# EAGLE design Rigid-Flex HDMI Switch (EAGLE 9.6.2)
CHECKED_BY: Maxim Yudayev; MADE_BY: Maxim Yudayev; RELEASE_DATE: May 7th, 2021; REV: v1.0; STATUS: Released

## Sheet 1 of 2: Cover
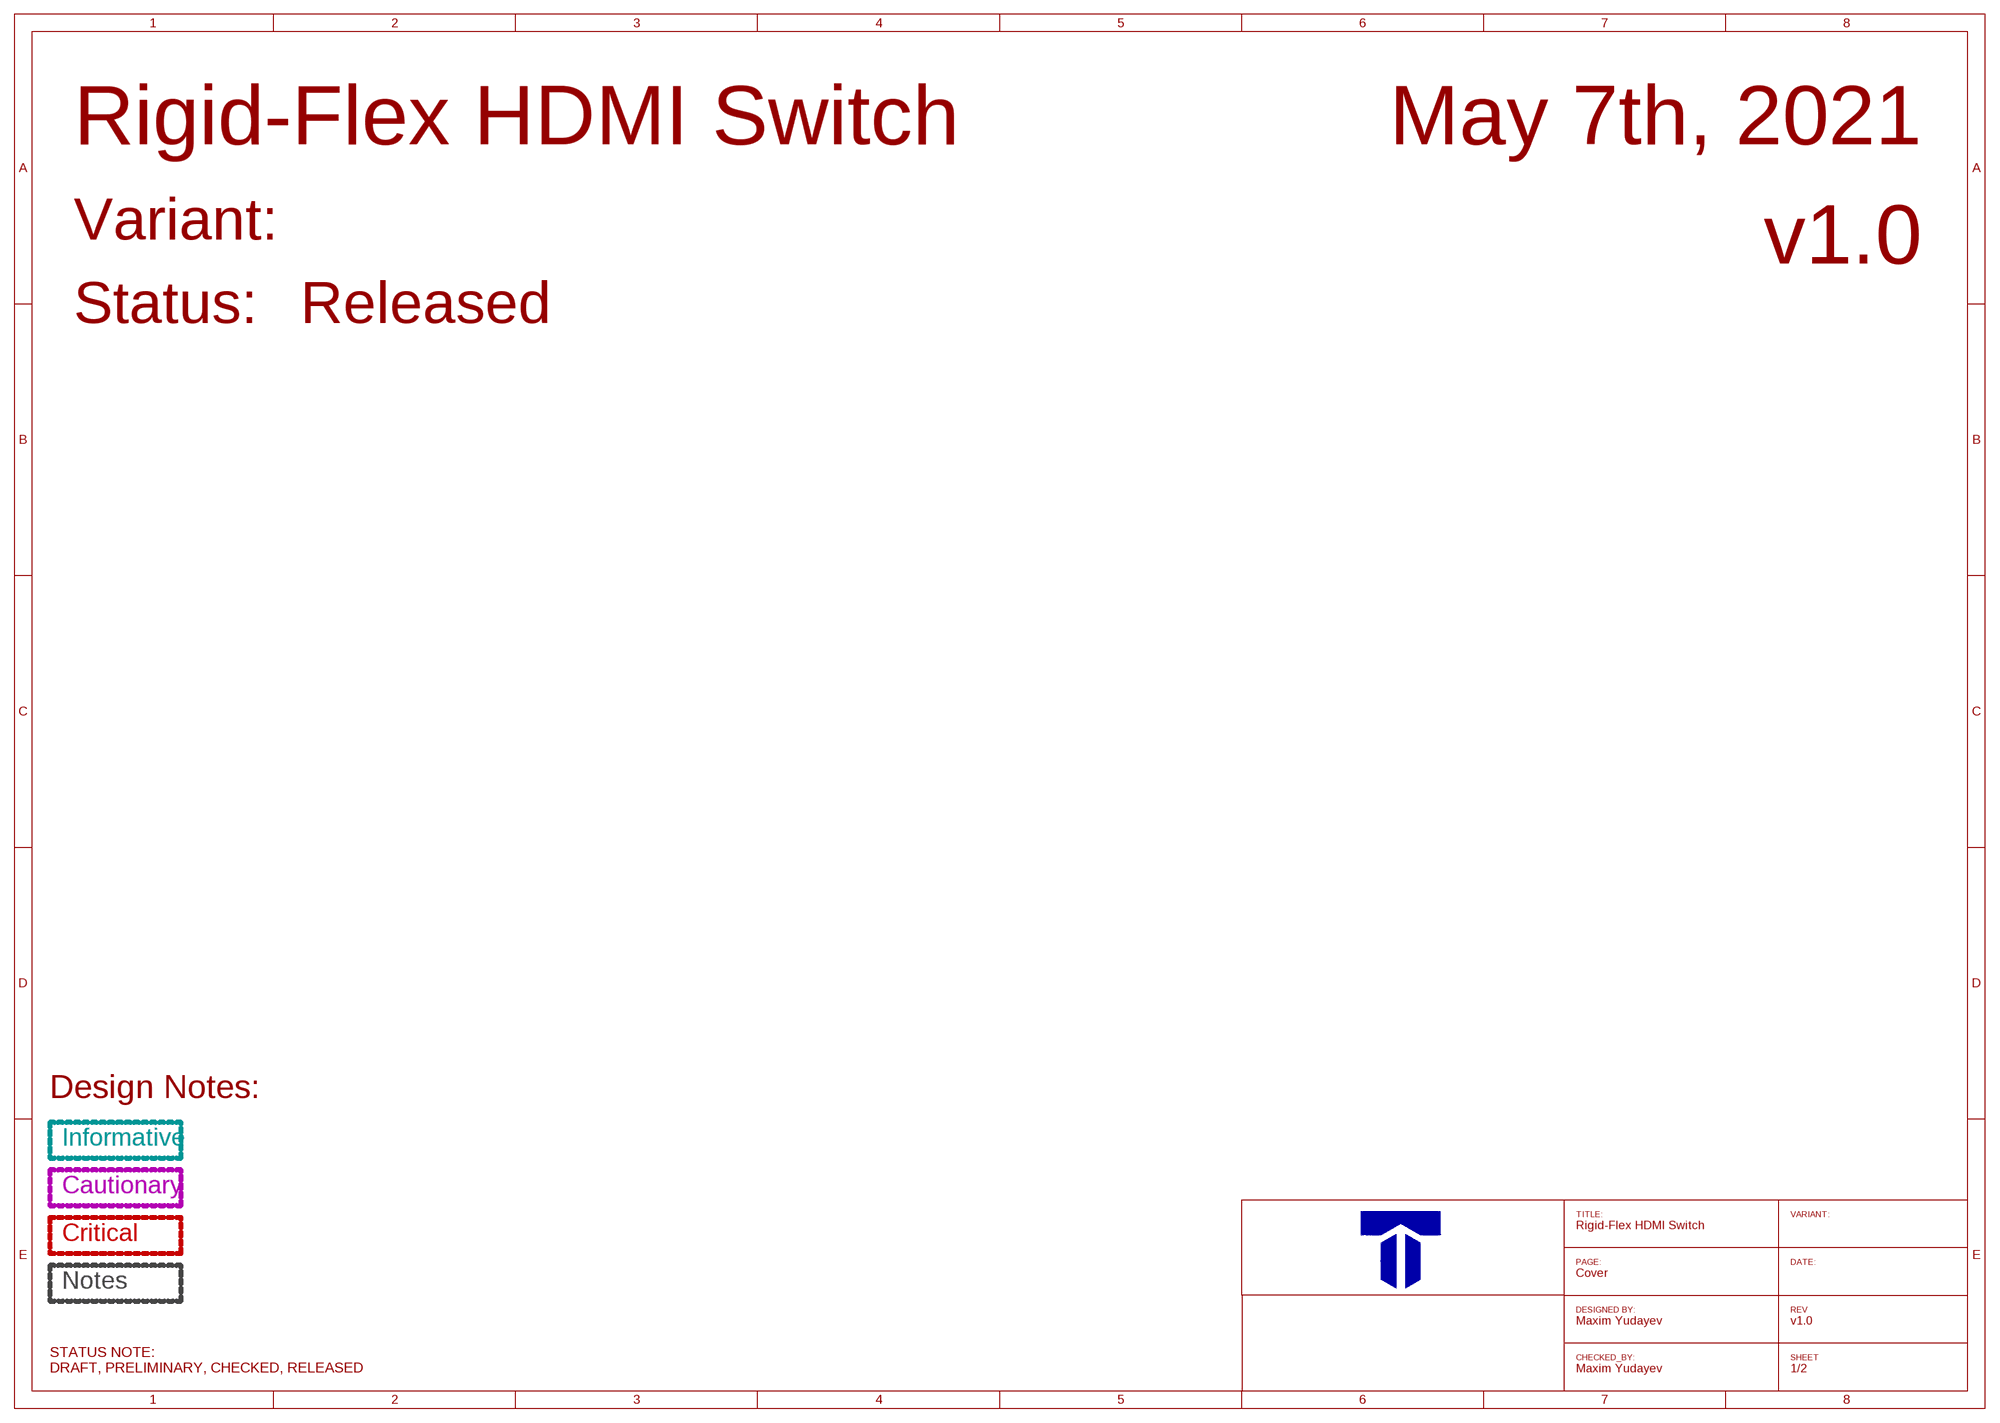
[diagram p0: schematic, sheet 1]

## Sheet 2 of 2: HDMI Switch
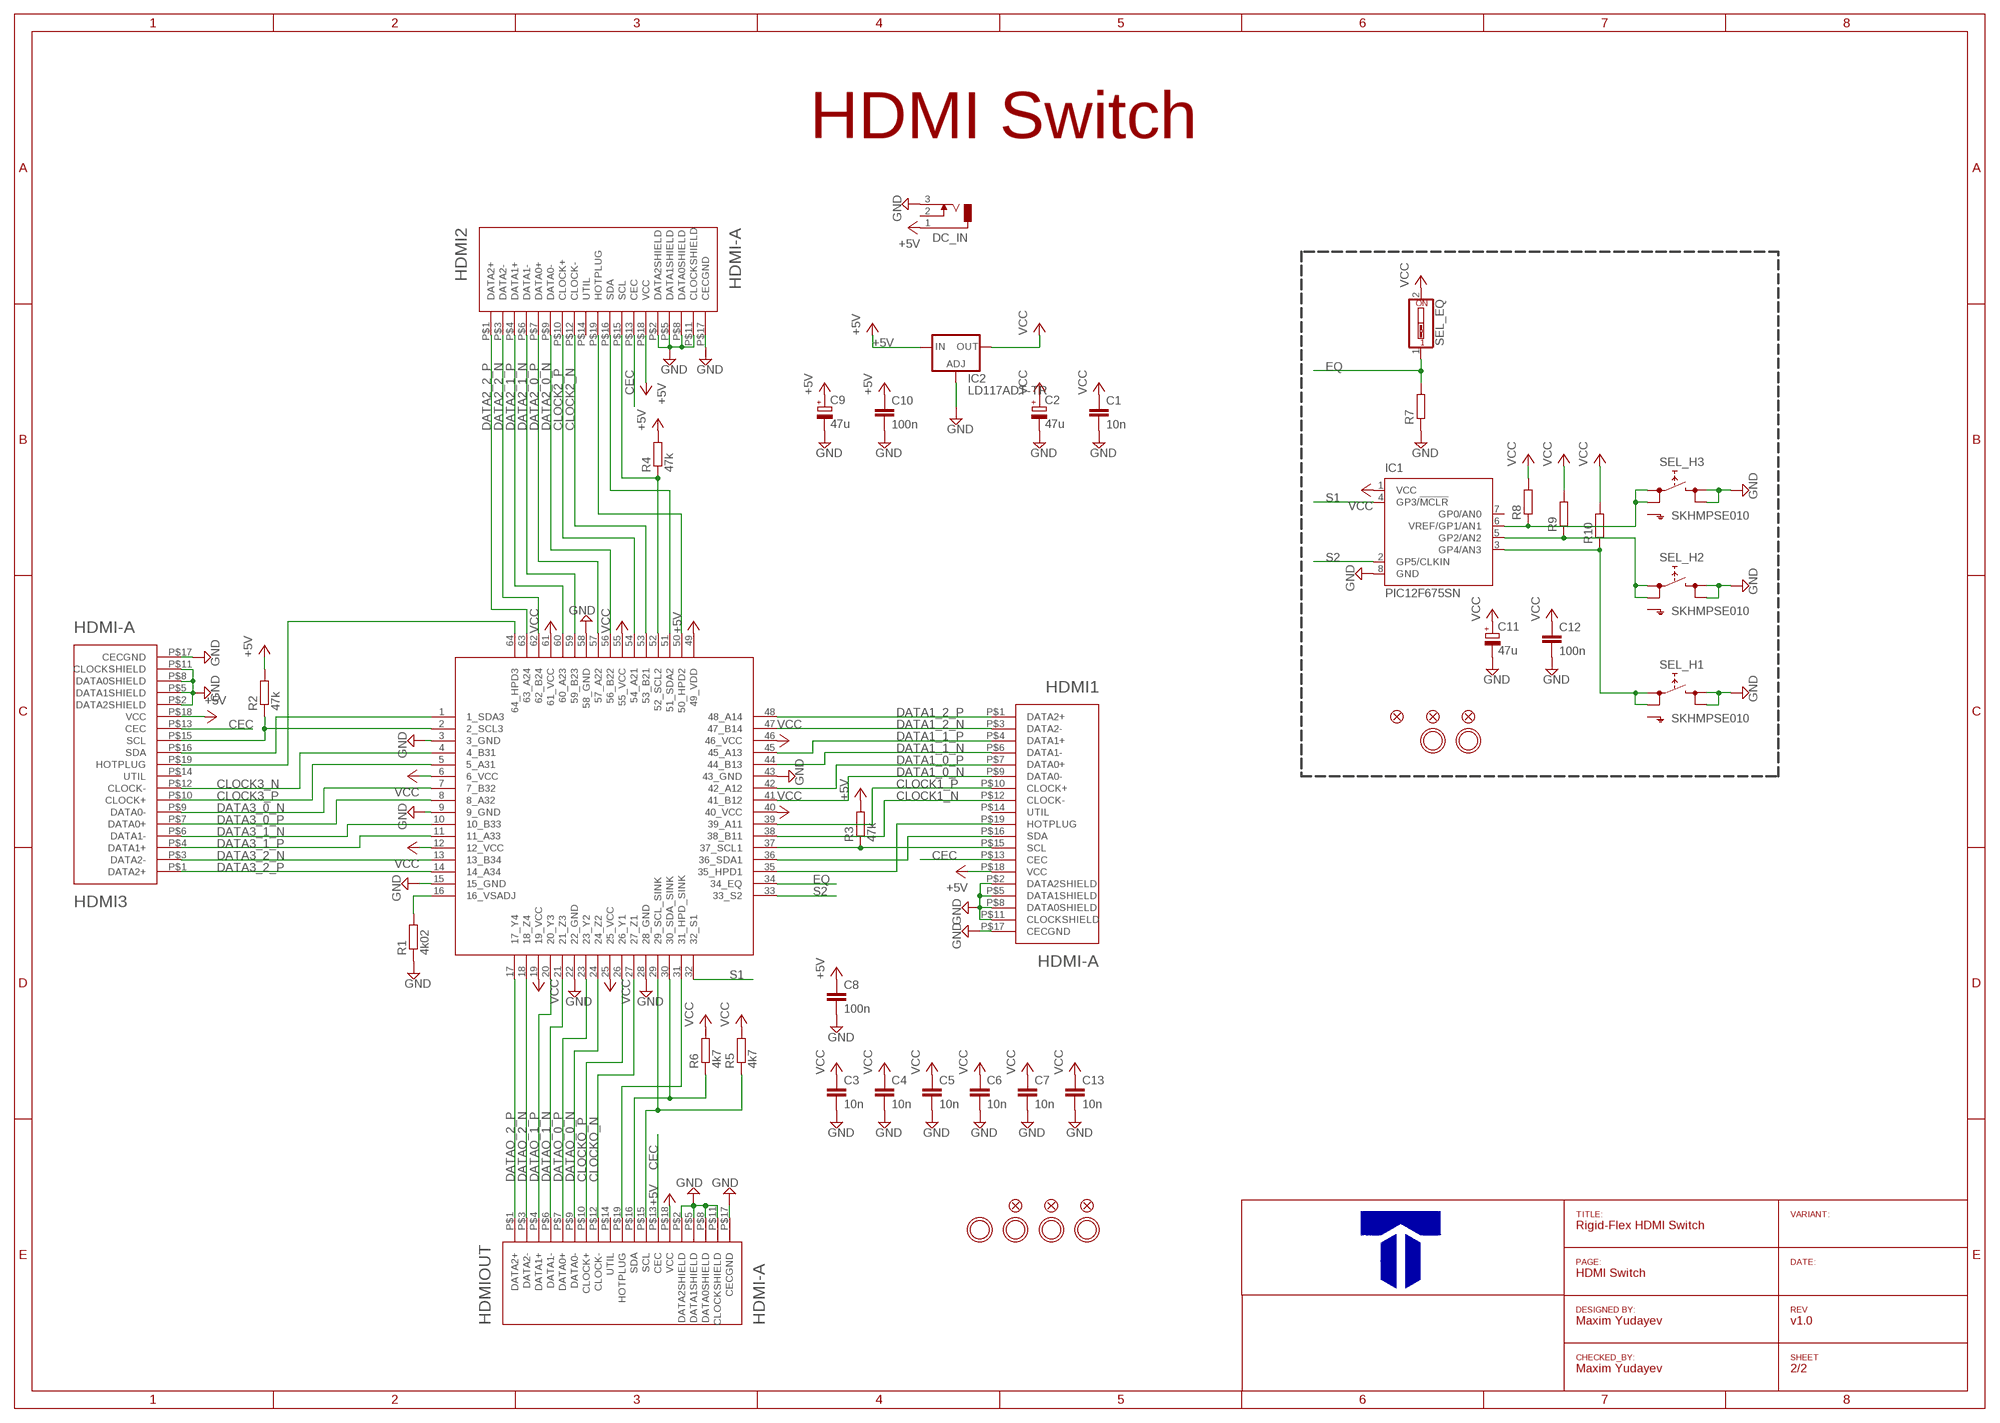
[diagram p1: schematic, sheet 2]

### Parts
C1  10n  C-EUC0402  [C0402]
C2  47u  CPOL-EUSMCA  [SMC_A]
C3  10n  C0402  [0402]
C4  10n  C0402  [0402]
C5  10n  C0402  [0402]
C6  10n  C0402  [0402]
C7  10n  C0402  [0402]
C8  100n  C0402  [0402]
C9  47u  CPOL-EUSMCA  [SMC_A]
C10  100n  C-EUC0402  [C0402]
C11  47u  CPOL-EUSMCA  [SMC_A]
C12  100n  C-EUC0402  [C0402]
C13  10n  C0402  [0402]
DC_IN  DCJ0303  [DCJ0303]
FID1  FIDUCIAL""  [FIDUCIAL_1MM]
FID2  FIDUCIAL""  [FIDUCIAL_1MM]
FID3  FIDUCIAL""  [FIDUCIAL_1MM]
FID4  FIDUCIAL""  [FIDUCIAL_1MM]
FID5  FIDUCIAL""  [FIDUCIAL_1MM]
FID6  FIDUCIAL""  [FIDUCIAL_1MM]
HDMI1  HDMI-A  [HDMI_A]
HDMI2  HDMI-A  [HDMI_A]
HDMI3  HDMI-A  [HDMI_A]
HDMIOUT  HDMI-A  [HDMI_A]
IC1  PIC12F675SN  [SO-08]
IC2  LD117ADT-TR  [DPACK]
R1  4k02  R0402  [0402]
R2  47k  R0402  [0402]
R3  47k  R0402  [0402]
R4  47k  R0402  [0402]
R5  4k7  R0402  [0402]
R6  4k7  R0402  [0402]
R7  R-EU_R0805  [R0805]
R8  R-EU_R0805  [R0805]
R9  R-EU_R0805  [R0805]
R10  R-EU_R0805  [R0805]
SEL_EQ  SW_DIP-1  [EDG-01]
SEL_H1  SKHMPSE010  [SKHMPXE010]
SEL_H2  SKHMPSE010  [SKHMPXE010]
SEL_H3  SKHMPSE010  [SKHMPXE010]
U1  TMDS351TQFP64  [QFP50P1200X1200X120-64]
U$1  MOUNTINGHOLE3.0  [MOUNTINGHOLE_3.0_PLATED]
U$2  MOUNTINGHOLE3.0  [MOUNTINGHOLE_3.0_PLATED]
U$31  MOUNTINGHOLE3.0  [MOUNTINGHOLE_3.0_PLATED]
U$32  MOUNTINGHOLE3.0  [MOUNTINGHOLE_3.0_PLATED]
U$33  MOUNTINGHOLE3.0  [MOUNTINGHOLE_3.0_PLATED]
U$34  MOUNTINGHOLE3.0  [MOUNTINGHOLE_3.0_PLATED]

### Nets
+5V: C8.1 C9.+ C10.1 DC_IN.1 HDMI1.P$18(VCC) HDMI2.P$18(VCC) HDMI3.P$18(VCC) HDMIOUT.P$18(VCC) IC2.3(IN) R2.2 R3.2 R4.2 U1.49(49_VDD)
CEC: HDMI1.P$13(CEC) HDMI2.P$13(CEC) HDMI3.P$13(CEC) HDMIOUT.P$13(CEC)
CLOCK1_N [100Ohm Diff]: HDMI1.P$12(CLOCK-) U1.38(38_B11)
CLOCK1_P [100Ohm Diff]: HDMI1.P$10(CLOCK+) U1.39(39_A11)
CLOCK2_N [100Ohm Diff]: HDMI2.P$12(CLOCK-) U1.53(53_B21)
CLOCK2_P [100Ohm Diff]: HDMI2.P$10(CLOCK+) U1.54(54_A21)
CLOCK3_N [100Ohm Diff]: HDMI3.P$12(CLOCK-) U1.4(4_B31)
CLOCK3_P [100Ohm Diff]: HDMI3.P$10(CLOCK+) U1.5(5_A31)
CLOCKO_N [100Ohm Diff]: HDMIOUT.P$12(CLOCK-) U1.27(27_Z1)
CLOCKO_P [100Ohm Diff]: HDMIOUT.P$10(CLOCK+) U1.26(26_Y1)
DATA1_0_N [100Ohm Diff]: HDMI1.P$9(DATA0-) U1.41(41_B12)
DATA1_0_P [100Ohm Diff]: HDMI1.P$7(DATA0+) U1.42(42_A12)
DATA1_1_N [100Ohm Diff]: HDMI1.P$6(DATA1-) U1.44(44_B13)
DATA1_1_P [100Ohm Diff]: HDMI1.P$4(DATA1+) U1.45(45_A13)
DATA1_2_N [100Ohm Diff]: HDMI1.P$3(DATA2-) U1.47(47_B14)
DATA1_2_P [100Ohm Diff]: HDMI1.P$1(DATA2+) U1.48(48_A14)
DATA2_0_N [100Ohm Diff]: HDMI2.P$9(DATA0-) U1.56(56_B22)
DATA2_0_P [100Ohm Diff]: HDMI2.P$7(DATA0+) U1.57(57_A22)
DATA2_1_N [100Ohm Diff]: HDMI2.P$6(DATA1-) U1.59(59_B23)
DATA2_1_P [100Ohm Diff]: HDMI2.P$4(DATA1+) U1.60(60_A23)
DATA2_2_N [100Ohm Diff]: HDMI2.P$3(DATA2-) U1.62(62_B24)
DATA2_2_P [100Ohm Diff]: HDMI2.P$1(DATA2+) U1.63(63_A24)
DATA3_0_N [100Ohm Diff]: HDMI3.P$9(DATA0-) U1.7(7_B32)
DATA3_0_P [100Ohm Diff]: HDMI3.P$7(DATA0+) U1.8(8_A32)
DATA3_1_N [100Ohm Diff]: HDMI3.P$6(DATA1-) U1.10(10_B33)
DATA3_1_P [100Ohm Diff]: HDMI3.P$4(DATA1+) U1.11(11_A33)
DATA3_2_N [100Ohm Diff]: HDMI3.P$3(DATA2-) U1.13(13_B34)
DATA3_2_P [100Ohm Diff]: HDMI3.P$1(DATA2+) U1.14(14_A34)
DATAO_0_N [100Ohm Diff]: HDMIOUT.P$9(DATA0-) U1.24(24_Z2)
DATAO_0_P [100Ohm Diff]: HDMIOUT.P$7(DATA0+) U1.23(23_Y2)
DATAO_1_N [100Ohm Diff]: HDMIOUT.P$6(DATA1-) U1.21(21_Z3)
DATAO_1_P [100Ohm Diff]: HDMIOUT.P$4(DATA1+) U1.20(20_Y3)
DATAO_2_N [100Ohm Diff]: HDMIOUT.P$3(DATA2-) U1.18(18_Z4)
DATAO_2_P [100Ohm Diff]: HDMIOUT.P$1(DATA2+) U1.17(17_Y4)
EQ: R7.2 SEL_EQ.1 U1.34(34_EQ)
GND: C1.2 C2.- C3.2 C4.2 C5.2 C6.2 C7.2 C8.2 C9.- C10.2 C11.- C12.2 C13.2 DC_IN.3 HDMI1.P$2(DATA2SHIELD) HDMI1.P$5(DATA1SHIELD) HDMI1.P$8(DATA0SHIELD) HDMI1.P$11(CLOCKSHIELD) HDMI1.P$17(CECGND) HDMI2.P$2(DATA2SHIELD) HDMI2.P$5(DATA1SHIELD) HDMI2.P$8(DATA0SHIELD) HDMI2.P$11(CLOCKSHIELD) HDMI2.P$17(CECGND) HDMI3.P$2(DATA2SHIELD) HDMI3.P$5(DATA1SHIELD) HDMI3.P$8(DATA0SHIELD) HDMI3.P$11(CLOCKSHIELD) HDMI3.P$17(CECGND) HDMIOUT.P$2(DATA2SHIELD) HDMIOUT.P$5(DATA1SHIELD) HDMIOUT.P$8(DATA0SHIELD) HDMIOUT.P$11(CLOCKSHIELD) HDMIOUT.P$17(CECGND) IC1.8(GND) IC2.1(ADJ) R1.1 R7.1 SEL_H1.3(2.1) SEL_H1.4(2.2) SEL_H2.3(2.1) SEL_H2.4(2.2) SEL_H3.3(2.1) SEL_H3.4(2.2) U1.3(3_GND) U1.9(9_GND) U1.15(15_GND) U1.22(22_GND) U1.28(28_GND) U1.43(43_GND) U1.58(58_GND)
N$25: HDMI3.P$19(HOTPLUG) U1.64(64_HPD3)
N$26: HDMI2.P$19(HOTPLUG) U1.50(50_HPD2)
N$27: HDMI1.P$19(HOTPLUG) U1.35(35_HPD1)
N$36: HDMIOUT.P$19(HOTPLUG) U1.31(31_HPD_SINK)
N$37: HDMI3.P$16(SDA) U1.1(1_SDA3)
N$38: HDMI3.P$15(SCL) R2.1 U1.2(2_SCL3)
N$39: HDMI2.P$16(SDA) U1.51(51_SDA2)
N$40: HDMI2.P$15(SCL) R4.1 U1.52(52_SCL2)
N$41: HDMI1.P$15(SCL) R3.1 U1.37(37_SCL1)
N$42: HDMI1.P$16(SDA) U1.36(36_SDA1)
N$43: HDMIOUT.P$16(SDA) R6.1 U1.30(30_SDA_SINK)
N$44: HDMIOUT.P$15(SCL) R5.1 U1.29(29_SCL_SINK)
N$45: R1.2 U1.16(16_VSADJ)
N$50: IC1.6(VREF/GP1/AN1) R8.1 SEL_H3.1(1.1) SEL_H3.2(1.2)
N$51: IC1.5(GP2/AN2) R9.1 SEL_H2.1(1.1) SEL_H2.2(1.2)
N$52: IC1.3(GP4/AN3) R10.1 SEL_H1.1(1.1) SEL_H1.2(1.2)
S1: IC1.4(GP3/!MCLR) U1.32(32_S1)
S2: IC1.2(GP5/CLKIN) U1.33(33_S2)
VCC: C1.1 C2.+ C3.1 C4.1 C5.1 C6.1 C7.1 C11.+ C12.1 C13.1 IC1.1(VCC) IC2.4(OUT) R5.2 R6.2 R8.2 R9.2 R10.2 SEL_EQ.2 U1.6(6_VCC) U1.12(12_VCC) U1.19(19_VCC) U1.25(25_VCC) U1.40(40_VCC) U1.46(46_VCC) U1.55(55_VCC) U1.61(61_VCC)
Unconnected: DC_IN.2 HDMI1.P$14(UTIL) HDMI2.P$14(UTIL) HDMI3.P$14(UTIL) HDMIOUT.P$14(UTIL) IC1.7(GP0/AN0) SEL_H1.5(SH) SEL_H2.5(SH) SEL_H3.5(SH)

## Library data of the parts
C1 C10 C12 = rcl:C-EU: CAPACITOR, European symbol; SPICEPREFIX: C
C2 C9 C11 = rcl:CPOL-EU: POLARIZED CAPACITOR, European symbol; SPICEPREFIX: C
C3-C8 C13 = labHDE_rev3:C0402
DC_IN = con-jack:DCJ0303: DC POWER JACK Source: DCJ0303.pdf; OC_FARNELL: unknown; OC_NEWARK: unknown
FID1-FID6 = microbuilder:FIDUCIAL: Fiducial Alignment Points Various fiducial points for machine vision alignment.; BOM: EXCLUDE
HDMI1-HDMI3 HDMIOUT = labHDE_rev3:HDMI-A: Horizonal HDMI type "A" jack
IC1 = microchip:PIC12F675: 8-Pin FLASH-Based 8-Bit CMOS Microcontroller Precision Internal 4 MHz oscillator factory calibrated to ±1% Low Power Features: Standby Current: - 1 nA @ 2.0V, typical Operating Current: - 8.5µA @ 32 kHz, 2.0V, typical - 100µA @ 1 MHz, 2.0V, typical Watchdog Timer Current: - 300 nA @ 2.0V, typical Timer1 oscillator current: - 4µA @ 32 kHz, 2.0V, typical Analog-to-Digital Converter module: - 10-bit resolution - Programmable 4-channel input - Voltage reference input Source: http://www.microchip.com .. 41190E.pdf; MF: MICROCHIP; MPN: PIC12F675-E/SN; OC_FARNELL: 9759026; OC_NEWARK: 92C4341
IC2 = v-reg:LD117A?*: Low drop fixed and adjustable positive voltage regulators 1 A Source: http://www.st.com/stonline/products/literature/ds/7194/ld1117axx.pdf
R1-R6 = labHDE_rev3:R0402
R7-R10 = rcl:R-EU_: RESISTOR, European symbol; SPICEPREFIX: R
SEL_EQ = special:SW_DIP-1: DIP SWITCH
SEL_H1-SEL_H3 = switch:SKHMP*E010: 6.2 X 6.5mm TACT Switch (SMD) Source: http://www3.alps.co.jp/WebObjects/catalog.woa/PDF/E/Switch/Tact/SKHM/SKHM.PDF
U1 = labHDE_rev3:TMDS351
U$1 U$2 U$31-U$34 = microbuilder:MOUNTINGHOLE: Mounting Hole For #2 screws (0.086"/2.18mm width, 0.094"/2.4mm hole) use 2.5mm; BOM: EXCLUDE

## Net classes
1 100Ohm Diff: width 0.295 mm, clearance 0.15 mm

## Board
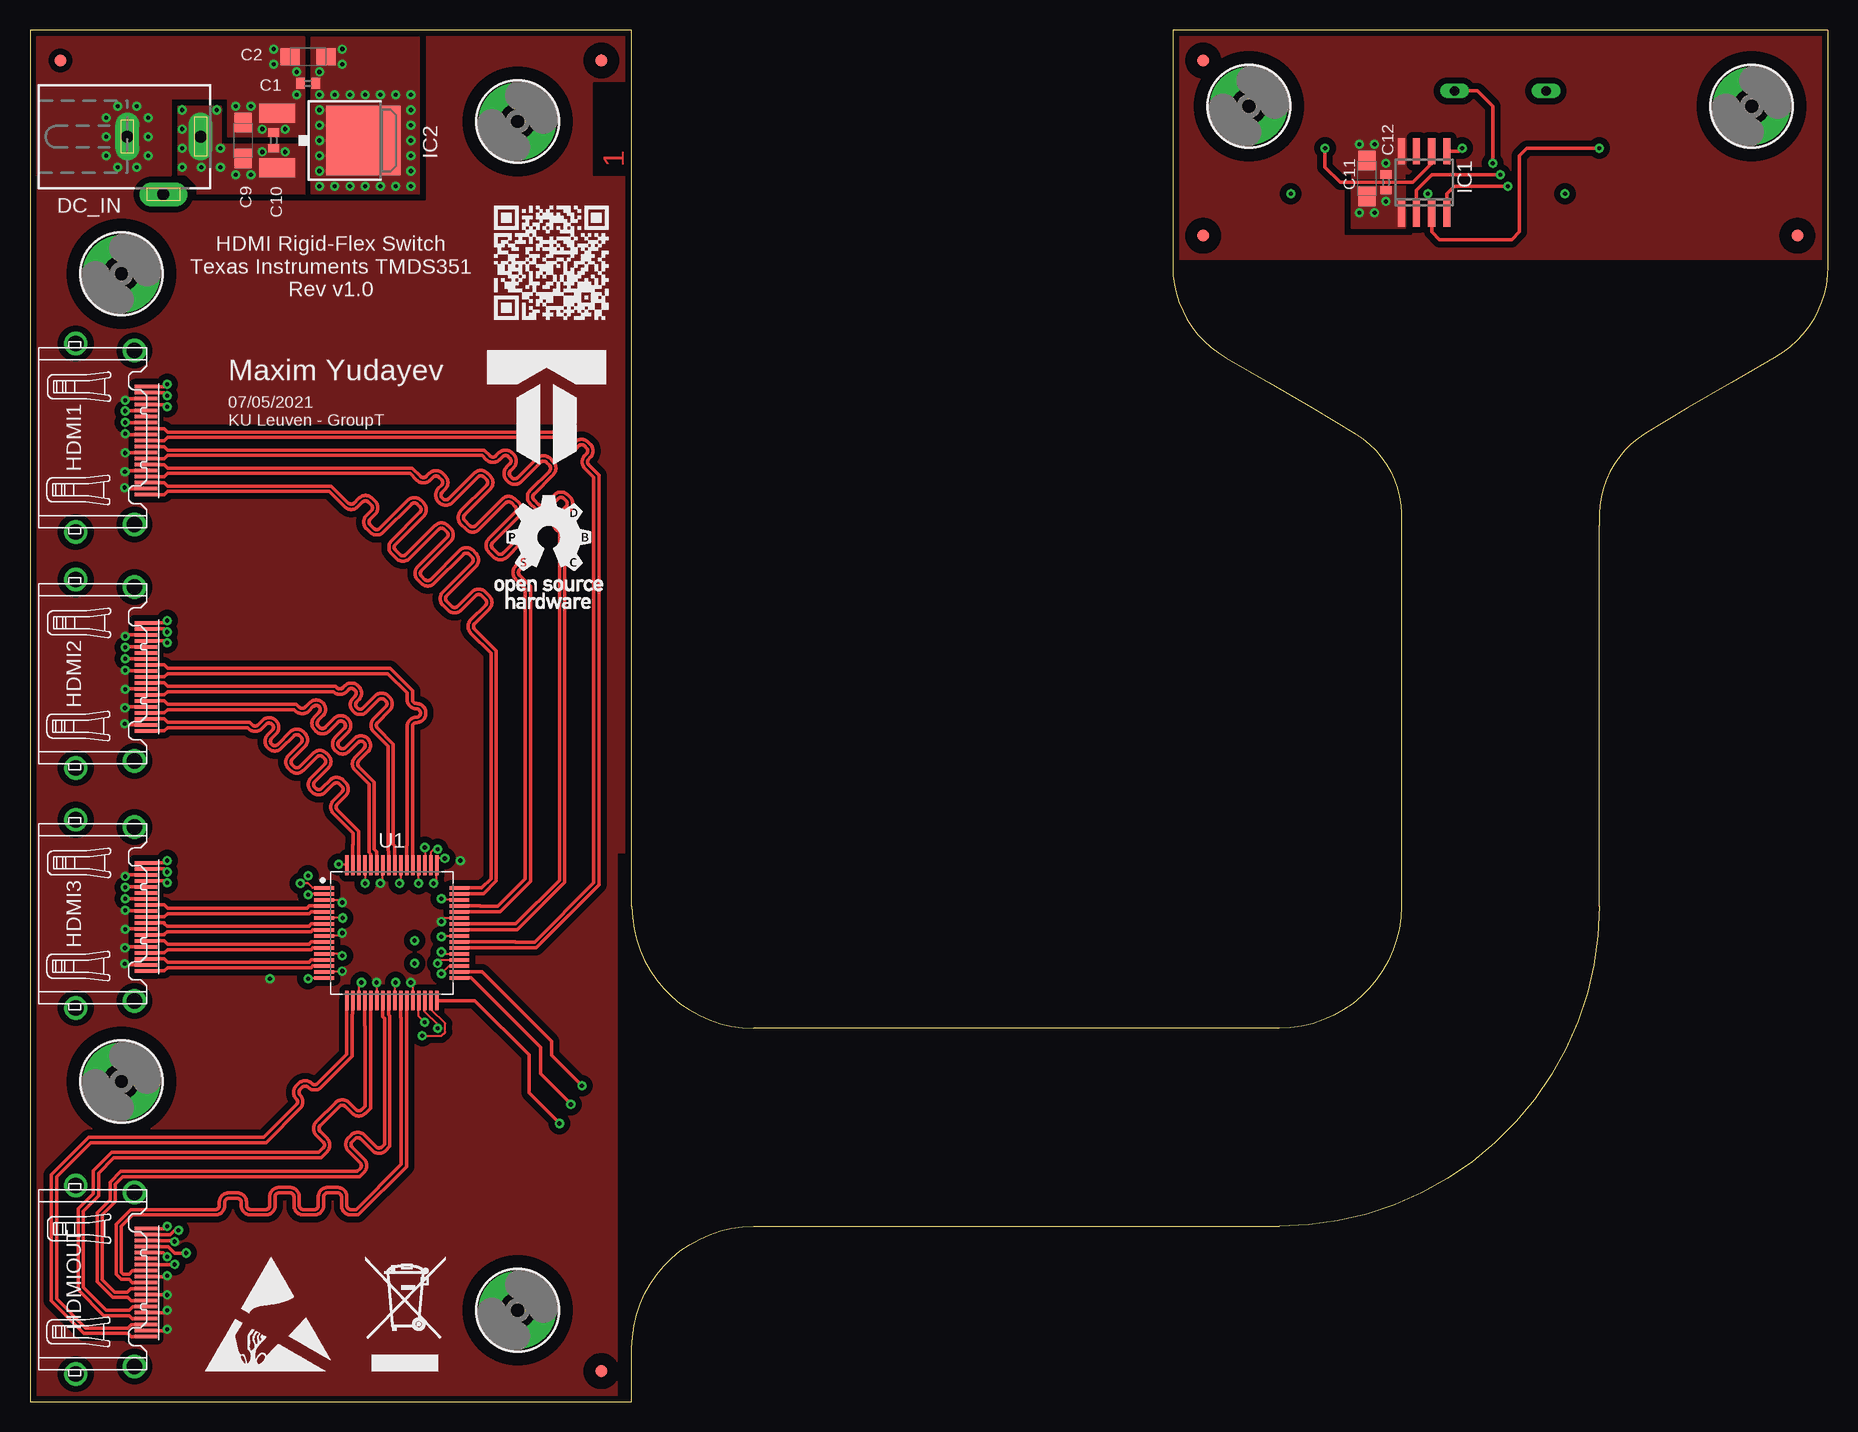
[diagram p2: board, top side]
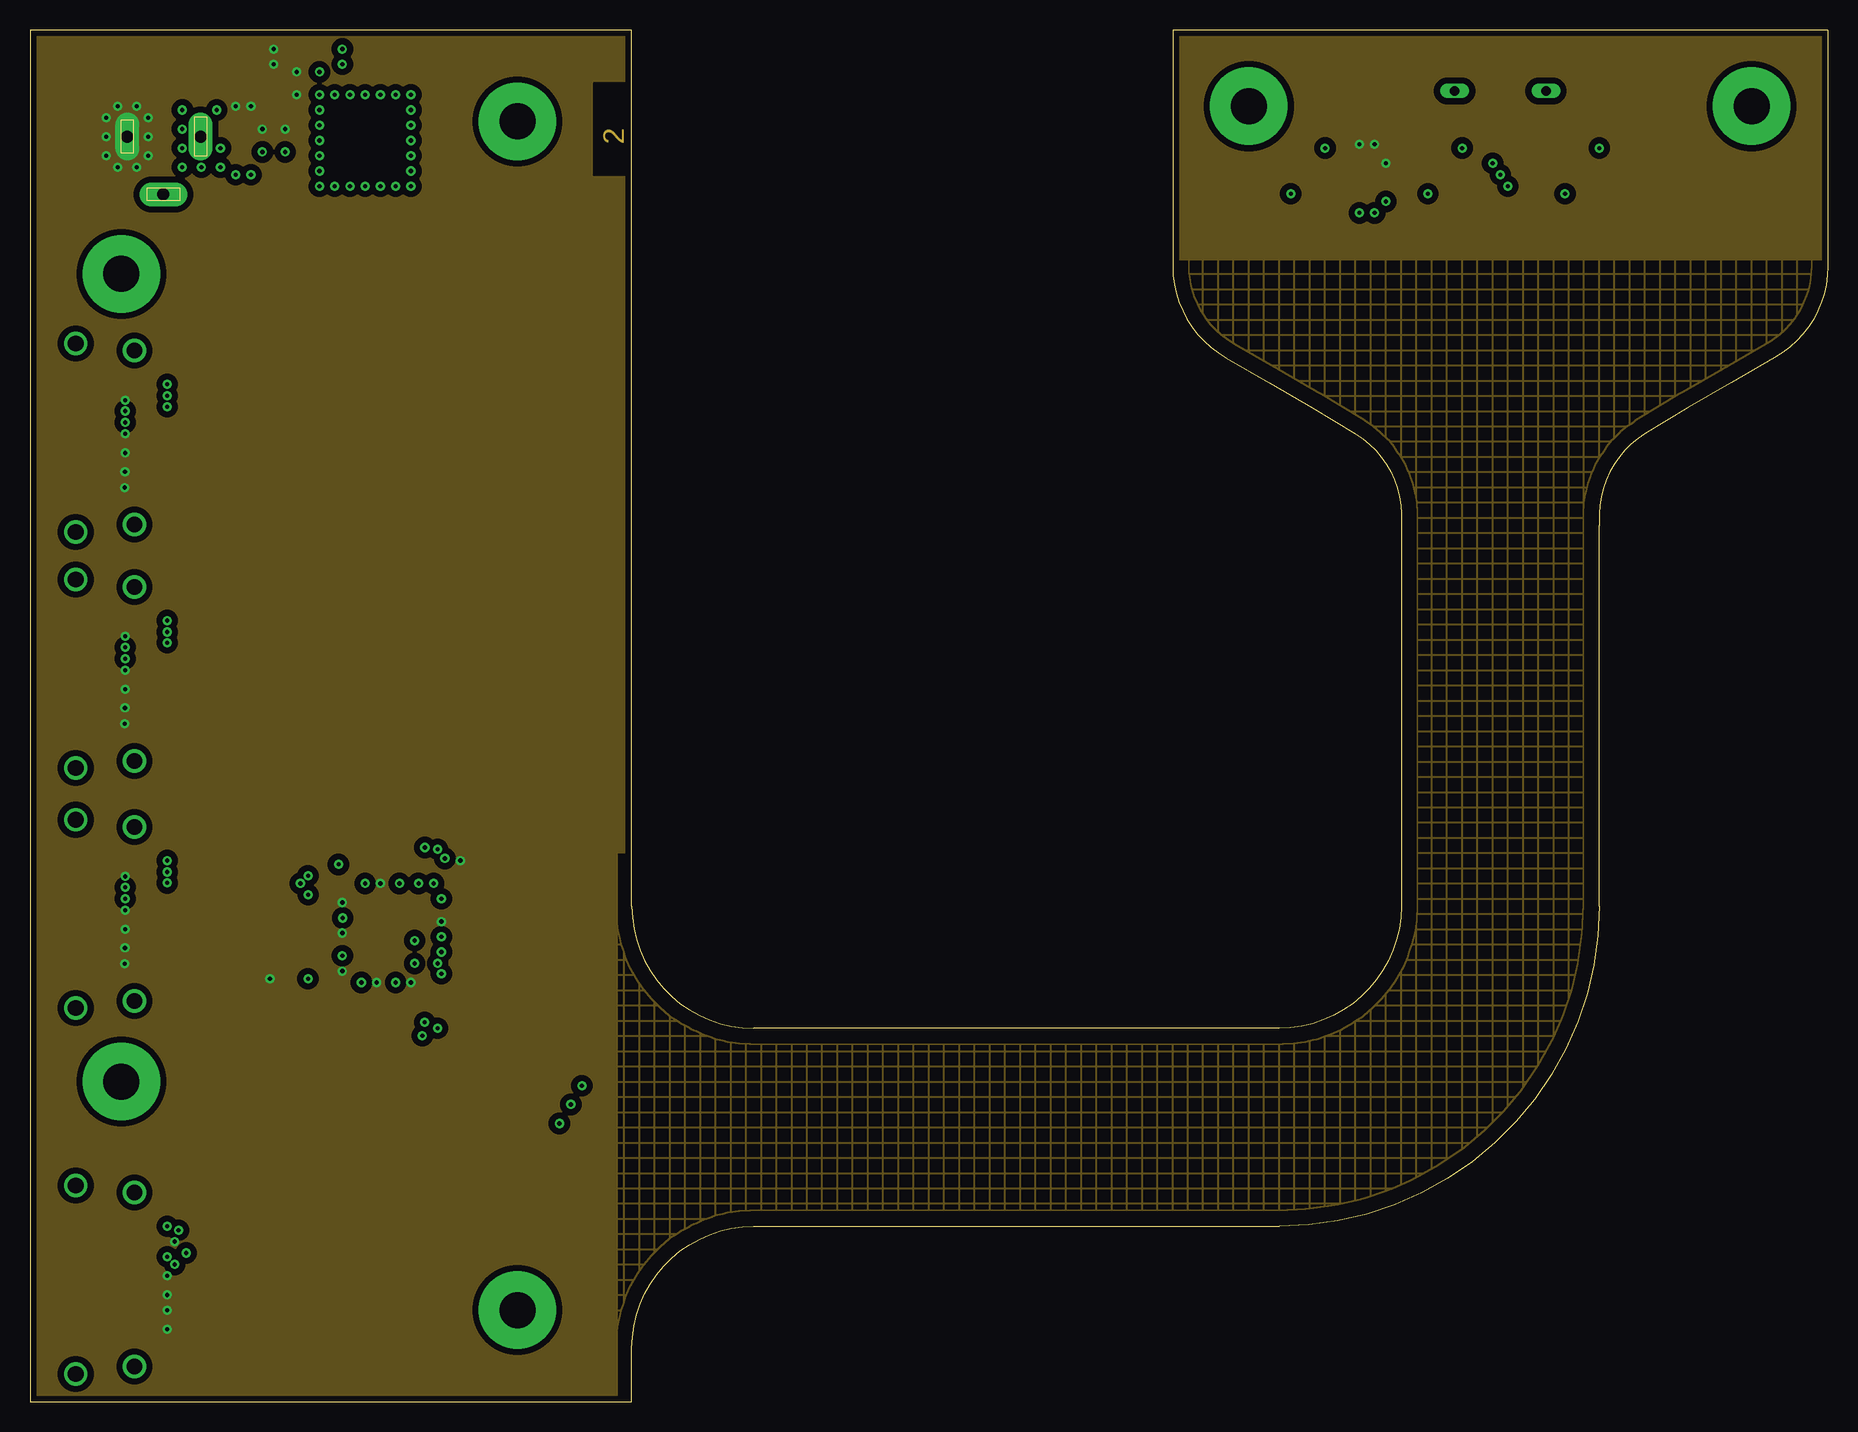
[diagram p3: board, inner layer Route2]
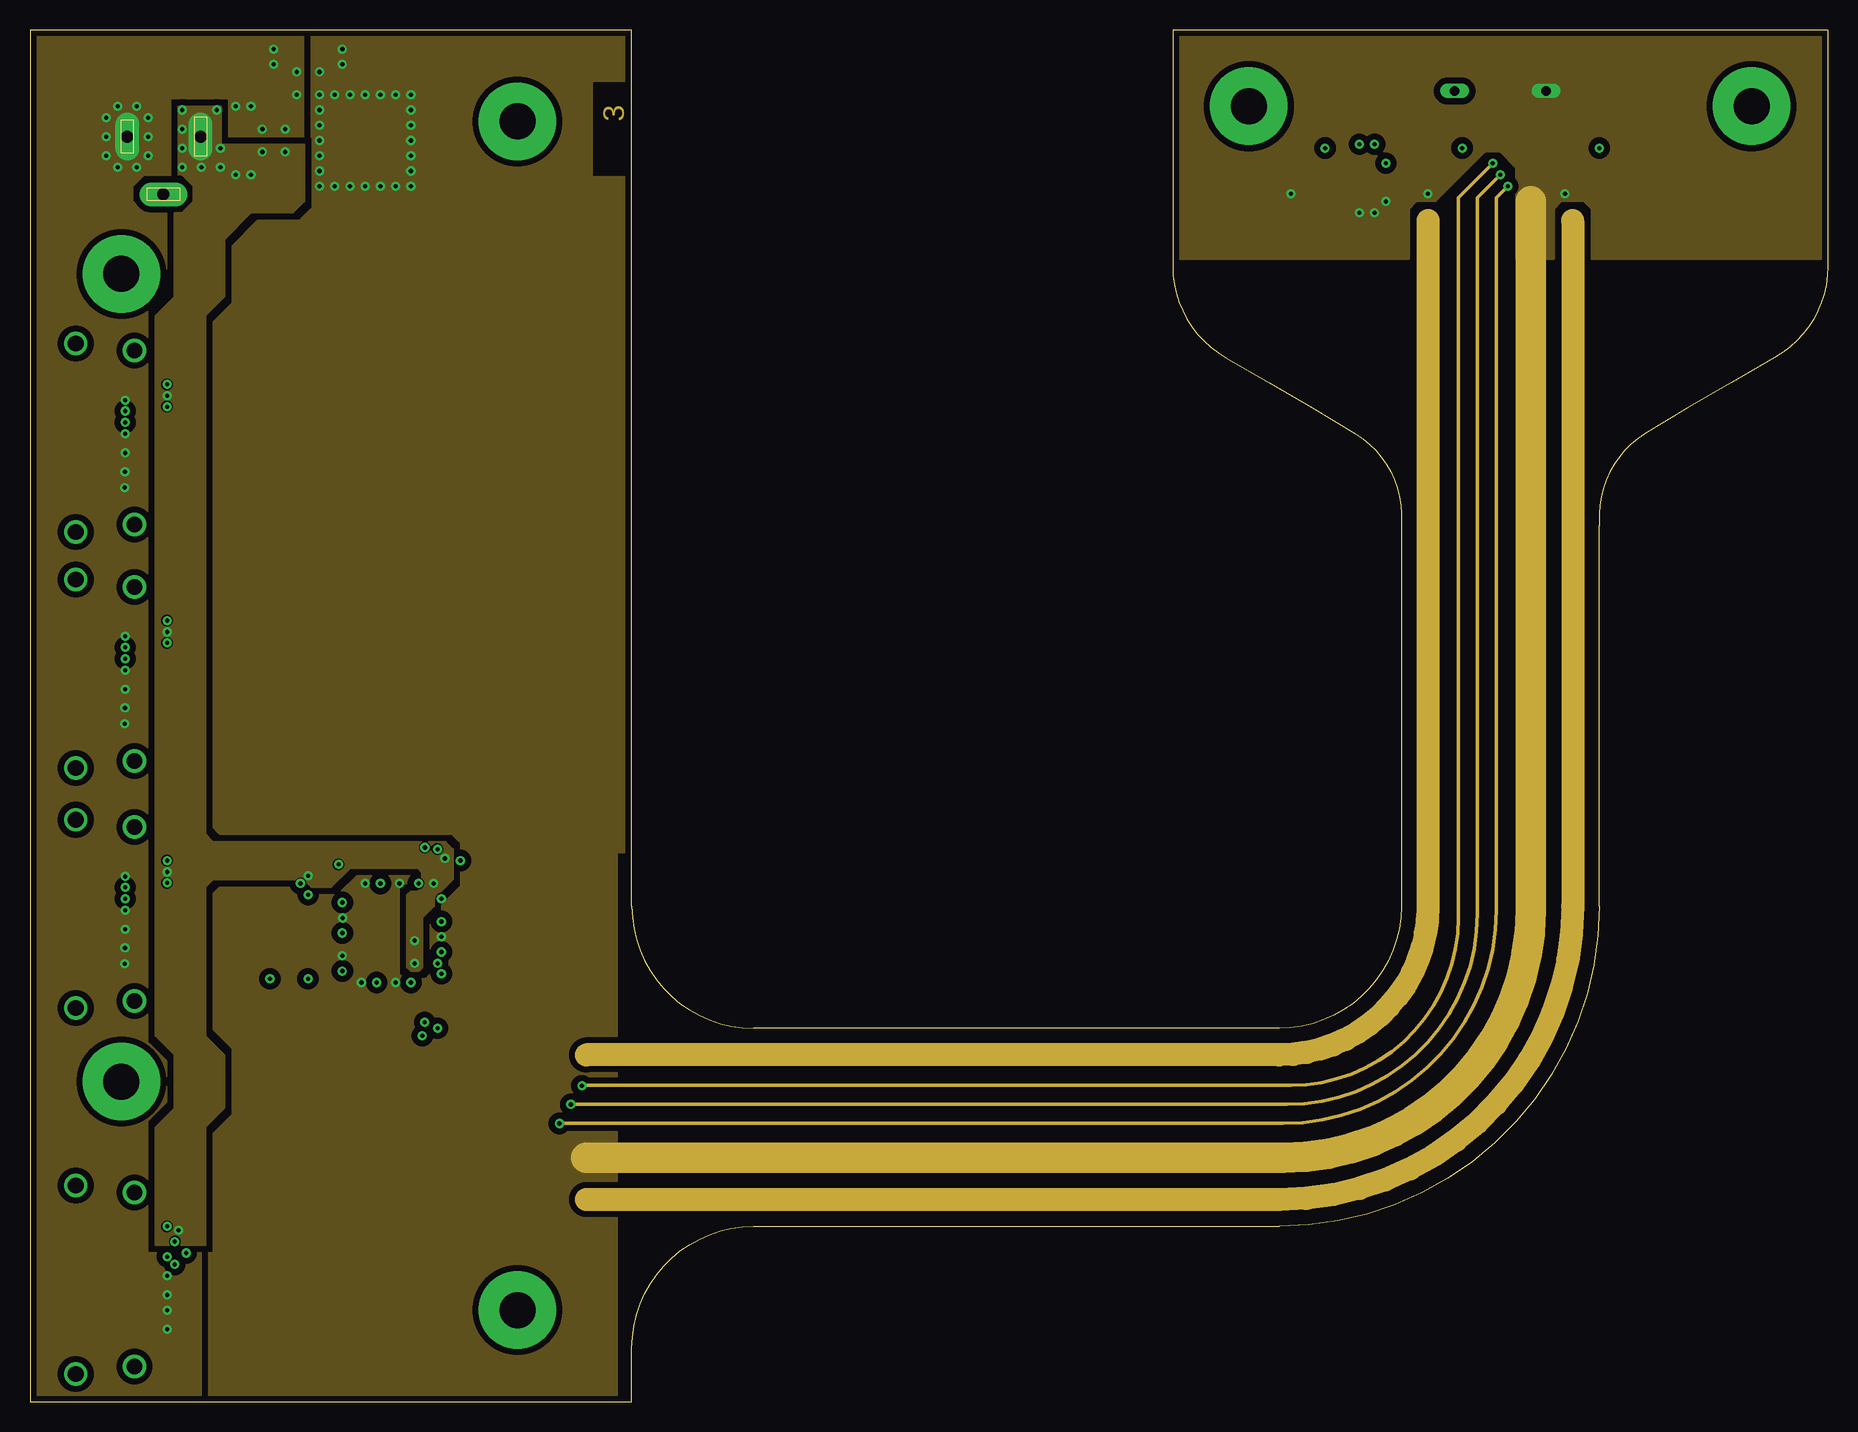
[diagram p4: board, inner layer Route15]
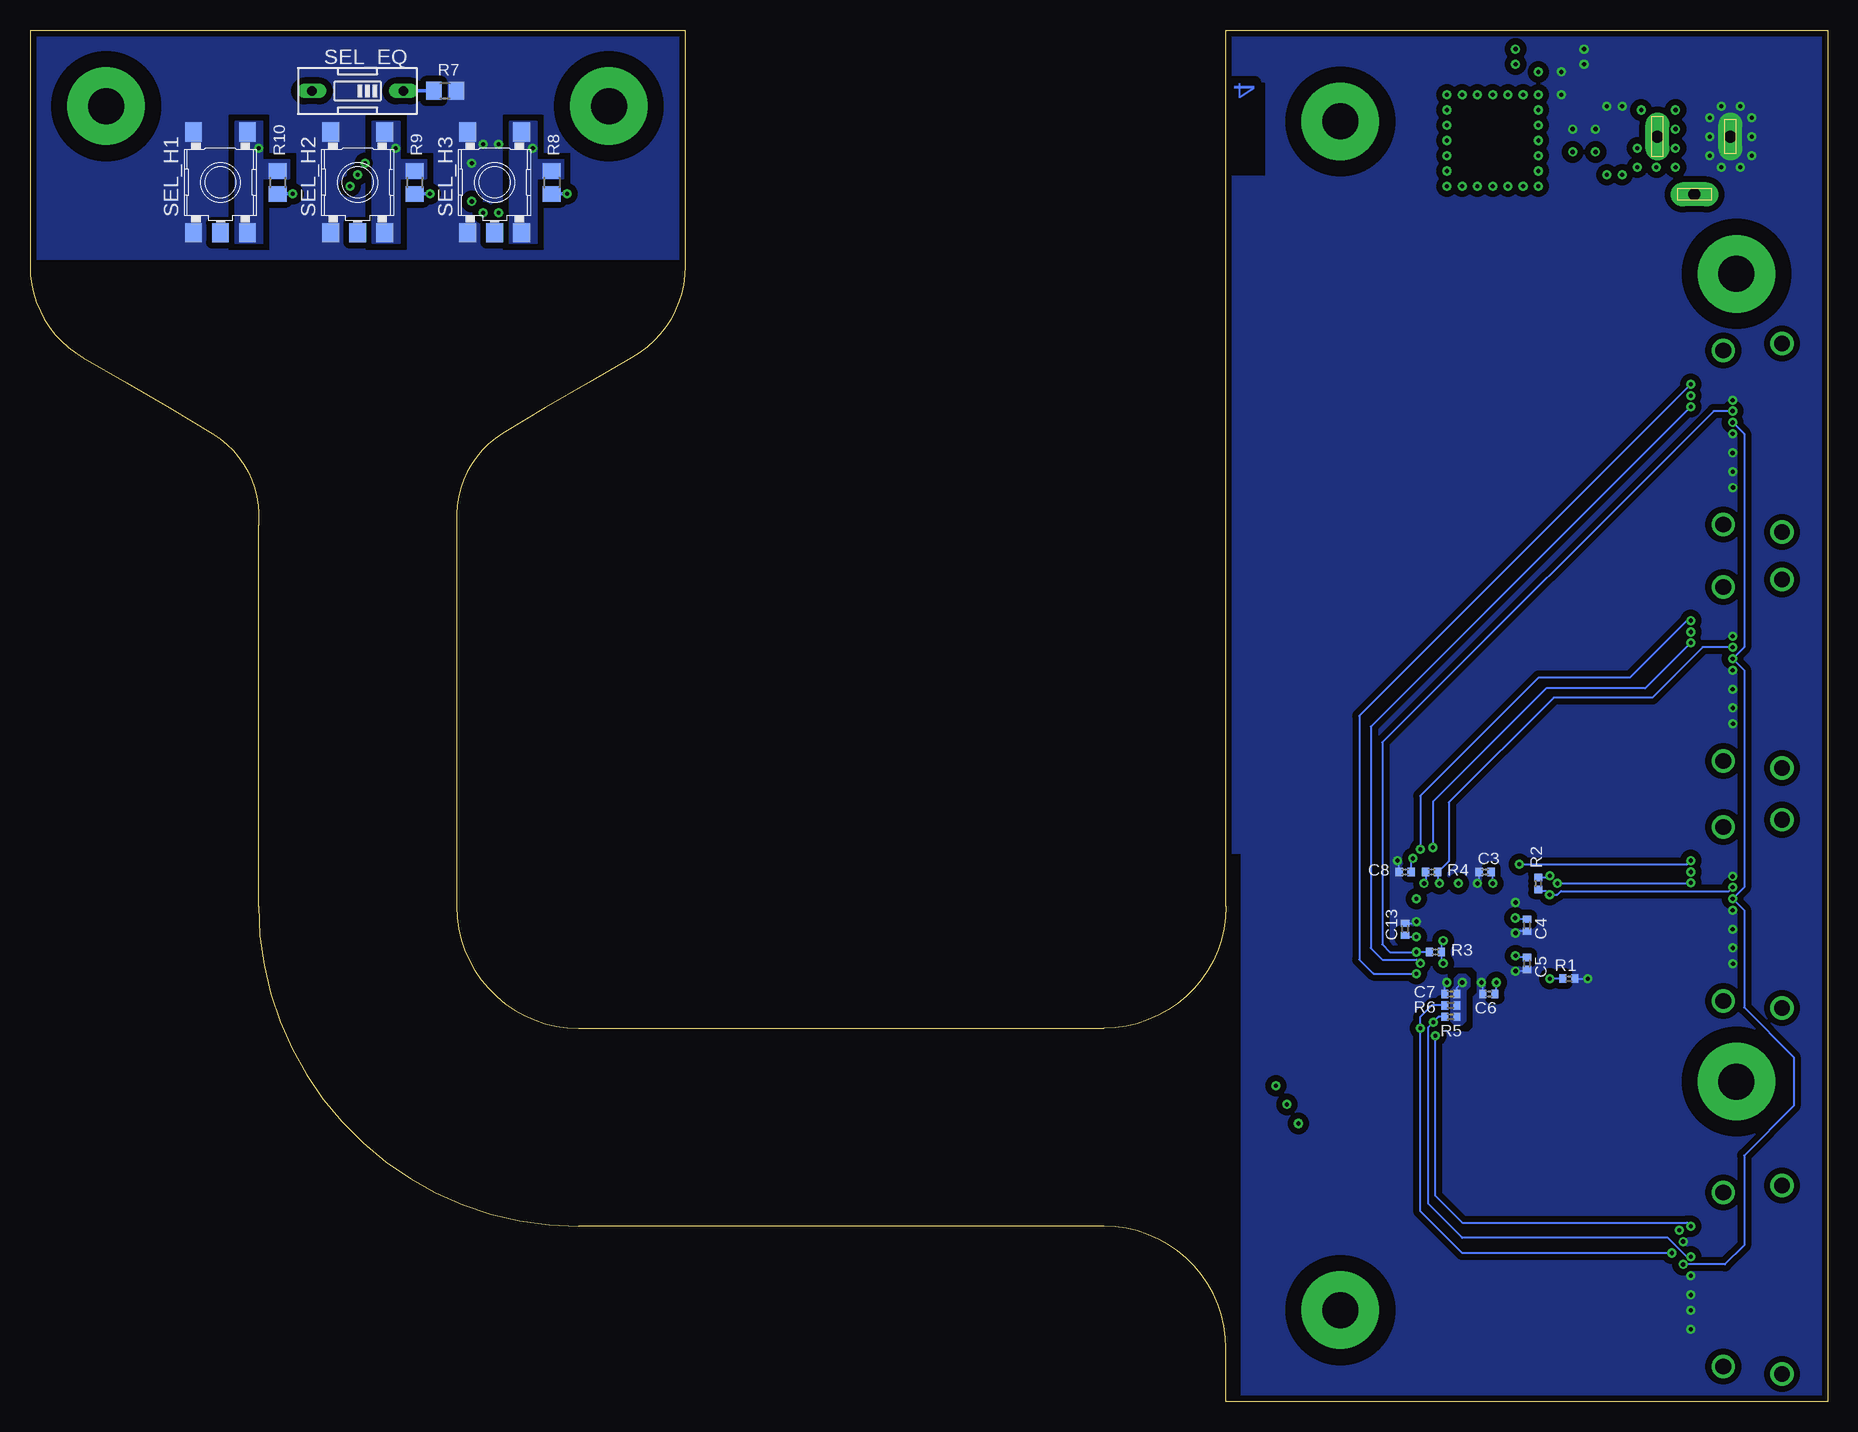
[diagram p5: board, bottom side, seen from below]

Size 149.86 x 114.3 mm. Coordinates in mm from the lower left corner, seen from the top.
Outline: 0,0 50.16,0 50.16,4.45 arc-90 60.33,14.61 104.14,14.61 arc90 130.81,41.27 130.81,73.03 arc-2 130.81,73.98 arc-58 134.62,80.64 arc-2 145.41,87 arc61 149.86,94.61 149.86,114.3 95.25,114.3 95.25,94.61 arc61 99.69,87 arc-2 110.49,80.64 arc-58 114.3,73.98 arc-2 114.3,73.03 114.3,41.27 arc-90 104.14,31.11 60.33,31.11 arc-90 50.16,41.27 50.16,114.3 0,114.3 0,0
Copper layers (1+2*15+16): Top 0.03mm / dielectric 0.285mm / Route2 0.017mm / dielectric 0.05mm / Route15 0.017mm / dielectric 0.285mm / Bottom 0.03mm
Design rules "default *": minimum track width 0.1mm, minimum drill 0.35mm, track to track 0.1mm, track to pad 0.1mm, pad to pad 0.1mm, via to via 0.1mm, smd to smd 0.1mm, copper to edge 0.3mm, drill to drill 6mil, minimum pad ring 0.175mm, minimum via ring 8mil, stop-mask expansion 4mil, vias tented up to drill 0mil, thermal gap 10mil

### Footprints (pad centres in the part's own frame; a part is rotated, then mirrored left to right if it is on the bottom)
C0402 = smd 0.7 x 0.9: 1 -0.65,0; 2 0.65,0
SMC_A = smd 1.6 x 1.4: + -1.5,0; - 1.5,0
0402 = smd 0.6 x 0.7: 1 -0.5,0; 2 0.5,0
DCJ0303 = drill 1 pad 2 long: 1 0,3.1; 2 4.8,0; 3 0,-3
FIDUCIAL_1MM = smd 1 x 1: 1 0,0
HDMI_A = smd 0.3 x 1.9: P$1 4.75,3.95; P$2 4.25,3.95; P$3 3.75,3.95; P$4 3.25,3.95; P$5 2.75,3.95; P$6 2.25,3.95; P$7 1.75,3.95; P$8 1.25,3.95; P$9 0.75,3.95; P$10 0.25,3.95; P$11 -0.25,3.95; P$12 -0.75,3.95; P$13 -1.25,3.95; P$14 -1.75,3.95; P$15 -2.25,3.95; P$16 -2.75,3.95; P$17 -3.25,3.95; P$18 -3.75,3.95; P$19 -4.25,3.95 | drill 1.3: P$20 -7.25,3; P$21 7.25,3; P$22 7.85,-1.9; P$23 -7.85,-1.9
SO-08 = smd 0.6 x 2.2: 1 -1.905,-2.6; 2 -0.635,-2.6; 3 0.635,-2.6; 4 1.905,-2.6; 5 1.905,2.6; 6 0.635,2.6; 7 -0.635,2.6; 8 -1.905,2.6
DPACK = smd 1.6 x 3: 1 -2.28,-4.8; 3 2.28,-4.8 | smd 5.8 x 6.2: 4 0,2.38
R0805 = smd 1.3 x 1.5: 1 -0.95,0; 2 0.95,0
EDG-01 = drill 0.813 long: 1 0,-3.81; 2 0,3.81
SKHMPXE010 = smd 1.6 x 1.4: 1 -4.2,2.25; 2 4.2,2.25; 3 -4.2,-2.25; 4 4.2,-2.25; 5 4.2,0
QFP50P1200X1200X120-64 = smd 1.652 x 0.28: 1 -5.632,3.75; 2 -5.632,3.25; 3 -5.632,2.75; 4 -5.632,2.25; 5 -5.632,1.75; 6 -5.632,1.25; 7 -5.632,0.75; 8 -5.632,0.25; 9 -5.632,-0.25; 10 -5.632,-0.75; 11 -5.632,-1.25; 12 -5.632,-1.75; 13 -5.632,-2.25; 14 -5.632,-2.75; 15 -5.632,-3.25; 16 -5.632,-3.75; 33 5.632,-3.75; 34 5.632,-3.25; 35 5.632,-2.75; 36 5.632,-2.25; 37 5.632,-1.75; 38 5.632,-1.25; 39 5.632,-0.75; 40 5.632,-0.25; 41 5.632,0.25; 42 5.632,0.75; 43 5.632,1.25; 44 5.632,1.75; 45 5.632,2.25; 46 5.632,2.75; 47 5.632,3.25; 48 5.632,3.75 | smd 0.28 x 1.652: 17 -3.75,-5.632; 18 -3.25,-5.632; 19 -2.75,-5.632; 20 -2.25,-5.632; 21 -1.75,-5.632; 22 -1.25,-5.632; 23 -0.75,-5.632; 24 -0.25,-5.632; 25 0.25,-5.632; 26 0.75,-5.632; 27 1.25,-5.632; 28 1.75,-5.632; 29 2.25,-5.632; 30 2.75,-5.632; 31 3.25,-5.632; 32 3.75,-5.632; 49 3.75,5.632; 50 3.25,5.632; 51 2.75,5.632; 52 2.25,5.632; 53 1.75,5.632; 54 1.25,5.632; 55 0.75,5.632; 56 0.25,5.632; 57 -0.25,5.632; 58 -0.75,5.632; 59 -1.25,5.632; 60 -1.75,5.632; 61 -2.25,5.632; 62 -2.75,5.632; 63 -3.25,5.632; 64 -3.75,5.632
MOUNTINGHOLE_3.0_PLATED = drill 3 pad 6.452: P$1 0,0

### Placement (x,y rotation side)
C1  23.18,109.86 180 top
C2  23.18,112.08 180 top
C3  28.57,44.13 180 bottom
C4  25.08,39.69 270 bottom
C5  25.08,36.51 270 bottom
C6  28.26,33.97 180 bottom
C7  31.43,33.97 180 bottom
C8  35.24,44.13 180 bottom
C9  17.78,105.09 90 top
C10  20.32,105.09 90 top
C11  111.44,101.92 90 top
C12  113.03,101.6 90 top
C13  35.24,39.37 90 bottom
DC_IN  11.11,105.41 270 top
FID1  97.79,111.76 0 top
FID2  147.32,97.16 0 top
FID3  97.79,97.16 0 top
FID4  47.62,111.76 0 top
FID5  47.62,2.54 0 top
FID6  2.54,111.76 0 top
HDMI1  5.71,80.33 270 top
HDMI2  5.71,60.64 270 top
HDMI3  5.71,40.64 270 top
HDMIOUT  5.71,10.16 270 top
IC1  116.2,101.6 0 top
IC2  25.4,105.09 270 top
R1  21.59,35.24 180 bottom
R2  24.13,43.18 90 bottom
R3  32.7,37.47 0 bottom
R4  33.02,44.13 180 bottom
R5  31.43,32.07 0 bottom
R6  31.43,33.02 0 bottom
R7  115.25,109.22 180 bottom
R8  106.36,101.6 270 bottom
R9  117.79,101.6 270 bottom
R10  129.22,101.6 270 bottom
SEL_EQ  122.56,109.22 90 bottom
SEL_H1  133.99,101.6 270 bottom
SEL_H2  122.56,101.6 270 bottom
SEL_H3  111.12,101.6 270 bottom
U1  30.16,39.05 0 top
U$1  40.64,7.62 0 top
U$2  7.62,26.67 0 top
U$31  40.64,106.68 0 top
U$32  7.62,93.98 0 top
U$33  143.51,107.95 0 top
U$34  101.6,107.95 0 top

### Tracks (layer width: path | path; a pad name or v marks a point on that pad's centre or on a via)
+5V  (via drill 0.35)
  Top 0.152: v34.58,45.26 33.91,45.26 U1.49 33.91,43.44 v33.66,43.18
  Top 0.295: HDMIOUT.P$18 11.69,13.91 12.06,14.29 v12.38,14.29 | v11.43,44.13 11.17,44.39 HDMI3.P$18 | v11.43,64.14 11.17,64.39 HDMI2.P$18 | v11.43,83.82 11.17,84.08 HDMI1.P$18
  Bottom 0.152: R2.2 23.31,43.68 v23.18,43.81 | R4.2 33.52,43.31 v33.66,43.18 | v34.58,45.26 34.74,45.1 C8.1 | v32.07,36.51 32.2,36.65 R3.2 32.2,38.28 v32.07,38.42
  other vias: 21.27,104.14 19.37,104.14 18.41,102.23 17.14,102.23 12.7,107.63 12.7,106.05 12.7,104.46 12.7,102.87 14.29,102.87 15.88,102.87 15.88,104.46 15.56,107.63
  pour Top (no thermals): 12.38,107.95 15.88,107.95 15.88,104.78 22.86,104.78 22.86,100.65 13.97,100.65 13.97,101.28 13.02,102.23 12.38,102.23
  pour Route15 (no thermals): 12.38,107.95 15.88,107.95 15.88,104.78 22.86,104.78 22.86,100.01 21.91,99.06 18.41,99.06 16.19,96.84 16.19,92.08 14.61,90.49 14.61,47.31 15.24,46.67 34.61,46.67 35.24,46.04 35.24,43.5 33.66,41.91 33.66,41.27 32.7,40.32 32.7,36.2 32.38,35.88 31.75,35.88 31.43,36.2 31.43,42.23 31.75,42.55 32.38,42.55 32.7,42.86 32.7,44.13 32.38,44.45 26.67,44.45 25.08,42.86 23.5,42.86 22.86,43.5 15.24,43.5 14.61,42.86 14.61,30.48 16.19,28.89 16.19,24.45 14.61,22.86 14.61,13.02 10.48,13.02 10.48,22.86 12.06,24.45 12.06,28.89 10.48,30.48 10.48,90.49 12.06,92.08 12.06,99.06 12.7,99.06 13.65,100.01 13.65,101.28 12.7,102.23 12.38,102.23
CEC  (via drill 0.35)
  Top 0.295: v12.06,11.43 12.04,11.41 HDMIOUT.P$13 | HDMI3.P$13 7.96,41.89 v7.94,41.91 | HDMI2.P$13 7.96,61.89 v7.94,61.91 | HDMI1.P$13 7.96,81.58 v7.94,81.6
  Bottom 0.152: v7.94,81.6 6.99,80.64 6.99,62.87 v7.94,61.91 6.99,60.96 6.99,42.86 v7.94,41.91 6.99,40.96 6.99,32.84 2.85,28.7 2.85,24.64 6.99,20.5 6.99,13.02 8.57,11.43 v12.06,11.43
CLOCK1_N
  Top 0.295: HDMI1.P$12 11.21,81.08 11.48,80.8 43.84,80.8 44.82,79.82 arc90 45.29,79.82 45.43,79.96 arc-90 46.53,79.96 46.7,79.78 arc-90 46.7,78.68 46.57,78.55 arc90 46.57,78.07 47.44,77.21 47.44,43.05 42.19,37.8 U1.38
CLOCK1_P
  Top 0.295: HDMI1.P$10 11.21,80.08 11.48,80.36 43.66,80.36 44.5,79.51 arc90 45.61,79.51 45.74,79.64 arc-90 46.22,79.64 46.39,79.47 arc-90 46.39,78.99 46.26,78.86 arc90 46.26,77.76 46.99,77.02 46.99,43.23 42.05,38.3 40.46,38.3 40.45,38.3 U1.39
CLOCK2_N
  Top 0.295: HDMI2.P$12 11.21,61.39 11.48,61.12 30,61.12 31.88,59.24 31.88,58.51 arc90 32.21,58.18 arc-90 32.99,57.4 32.99,57.37 arc-90 32.21,56.59 arc90 31.88,56.25 31.88,46.35 31.91,46.32 U1.53
CLOCK2_P
  Top 0.295: HDMI2.P$10 11.21,60.39 11.48,60.67 29.82,60.67 31.43,59.05 31.43,58.51 arc90 32.21,57.73 arc-90 32.55,57.4 32.55,57.37 arc-90 32.21,57.03 arc90 31.43,56.25 31.43,46.35 31.41,46.34 U1.54
CLOCK3_N
  Top 0.295: HDMI3.P$12 11.21,41.39 11.48,41.11 23.1,41.11 23.29,41.3 U1.4
CLOCK3_P
  Top 0.295: HDMI3.P$10 11.21,40.39 11.48,40.67 23.28,40.67 23.42,40.8 U1.5
CLOCKO_N
  Top 0.295: HDMIOUT.P$12 8.53,10.91 8.26,10.63 7.78,10.63 7.62,10.79 7.62,14.61 8.57,15.56 10.23,15.56 | U1.27 31.41,32.01 31.39,31.98 31.39,19.59 27.35,15.56 26.74,15.56 arc-90 25.96,16.34 25.96,17.07 arc90 25.63,17.41 24.82,17.41 arc90 24.48,17.07 24.48,16.34 arc-90 23.7,15.56 22.78,15.56 arc-90 22,16.34 22,17.07 arc90 21.67,17.41 20.77,17.41 arc90 20.43,17.07 20.43,16.34 arc-90 19.65,15.56 18.39,15.56 arc-90 17.61,16.34 17.61,16.61 arc90 17.27,16.94 16.57,16.94 arc90 16.23,16.61 16.23,16.34 arc-90 15.45,15.56 10.23,15.56 | 10.23,15.56
CLOCKO_P
  Top 0.295: HDMIOUT.P$10 8.53,9.91 8.26,10.19 7.6,10.19 7.17,10.61 7.17,14.79 8.39,16 15.45,16 arc90 15.79,16.34 15.79,16.61 arc-90 16.57,17.39 17.27,17.39 arc-90 18.05,16.61 18.05,16.34 arc90 18.39,16 19.65,16 arc90 19.98,16.34 19.98,17.07 arc-90 20.77,17.85 21.67,17.85 arc-90 22.45,17.07 22.45,16.34 arc90 22.78,16 23.7,16 arc90 24.04,16.34 24.04,17.07 arc-90 24.82,17.85 25.63,17.85 arc-90 26.41,17.07 26.41,16.34 arc90 26.74,16 27.17,16 30.94,19.77 30.94,31.98 30.91,32.01 U1.26
DATA1_0_N
  Top 0.295: HDMI1.P$9 11.21,79.58 11.48,79.3 37.85,79.3 38.35,78.81 arc90 38.82,78.81 39.08,79.07 arc-90 40.18,79.07 40.31,78.94 arc-90 40.31,77.83 40.05,77.58 arc90 40.05,77.1 40.17,76.98 arc90 40.64,76.98 42.25,78.59 arc-90 43.36,78.59 43.61,78.34 arc-90 43.61,77.23 42,75.62 arc90 42,75.15 42.41,74.74 arc90 42.88,74.74 43.72,75.57 arc-90 44.82,75.57 45.01,75.38 arc-90 45.01,74.28 44.18,73.45 arc90 44.18,72.98 44.58,72.57 44.58,43.28 40.6,39.3 U1.41
DATA1_0_P
  Top 0.295: HDMI1.P$7 11.21,78.58 11.48,78.86 37.67,78.86 38.03,78.49 arc90 39.13,78.49 39.4,78.75 arc-90 39.87,78.75 40,78.62 arc-90 40,78.15 39.74,77.89 arc90 39.74,76.79 39.85,76.67 arc90 40.96,76.67 42.57,78.28 arc-90 43.04,78.28 43.3,78.02 arc-90 43.3,77.55 41.69,75.94 arc90 41.69,74.84 42.1,74.43 arc90 43.2,74.43 44.03,75.26 arc-90 44.5,75.26 44.69,75.07 arc-90 44.69,74.59 43.86,73.76 arc90 43.86,72.66 44.13,72.39 44.13,43.47 40.48,39.81 35.81,39.81 U1.42
DATA1_1_N
  Top 0.295: HDMI1.P$6 11.21,78.08 11.48,77.8 31.86,77.8 32.56,77.1 arc90 33.03,77.1 33.29,77.36 arc-90 34.39,77.36 34.61,77.14 arc-90 34.61,76.03 34.36,75.78 arc90 34.36,75.31 34.42,75.24 arc90 34.9,75.24 37.03,77.37 arc-90 38.13,77.37 38.36,77.14 arc-90 38.36,76.03 36.23,73.91 arc90 36.23,73.43 36.66,73 arc90 37.13,73 39.34,75.21 arc-90 40.44,75.21 40.76,74.89 arc-90 40.76,73.78 38.56,71.58 arc90 38.56,71.11 38.97,70.7 arc90 39.44,70.7 40.53,71.79 arc-90 41.63,71.79 41.9,71.53 arc-90 41.9,70.42 40.81,69.33 arc90 40.81,68.86 41.72,67.94 41.72,43.38 39.17,40.83 37.53,40.83 37.51,40.8 U1.44
DATA1_1_P
  Top 0.295: HDMI1.P$4 11.21,77.08 11.48,77.36 31.68,77.36 32.24,76.79 arc90 33.35,76.79 33.6,77.04 arc-90 34.08,77.04 34.3,76.82 arc-90 34.3,76.35 34.04,76.09 arc90 34.04,74.99 34.11,74.93 arc90 35.21,74.93 37.34,77.06 arc-90 37.81,77.06 38.05,76.82 arc-90 38.05,76.35 35.92,74.22 arc90 35.92,73.12 36.35,72.69 arc90 37.45,72.69 39.66,74.89 arc-90 40.13,74.89 40.45,74.57 arc-90 40.45,74.1 38.24,71.89 arc90 38.24,70.79 38.65,70.38 arc90 39.75,70.38 40.85,71.47 arc-90 41.32,71.47 41.58,71.21 arc-90 41.58,70.74 40.49,69.64 arc90 40.49,68.54 41.27,67.76 41.27,43.57 38.98,41.27 37.53,41.27 37.5,41.3 U1.45
DATA1_2_N
  Top 0.295: HDMI1.P$3 11.21,76.58 11.48,76.3 25.12,76.3 26.54,74.88 arc90 27.02,74.88 27.41,75.28 arc-90 28.52,75.28 28.76,75.04 arc-90 28.76,73.94 28.36,73.53 arc90 28.36,73.06 28.66,72.76 arc90 29.14,72.76 31.49,75.11 arc-90 32.59,75.11 32.81,74.89 arc-90 32.81,73.78 30.46,71.44 arc90 30.46,70.96 30.85,70.57 arc90 31.32,70.57 33.75,73 arc-90 34.85,73 35.06,72.79 arc-90 35.06,71.69 32.64,69.26 arc90 32.64,68.79 32.91,68.51 arc90 33.39,68.51 35.81,70.93 arc-90 36.92,70.93 37.16,70.69 arc-90 37.16,69.58 34.74,67.16 arc90 34.74,66.69 35.16,66.27 arc90 35.63,66.27 36.84,67.48 arc-90 37.95,67.48 38.28,67.15 arc-90 38.28,66.05 37.06,64.83 arc90 37.06,64.36 38.86,62.56 38.86,43.39 37.8,42.33 37.45,42.33 37.42,42.3 U1.47
DATA1_2_P
  Top 0.295: HDMI1.P$1 11.21,75.58 11.48,75.86 24.94,75.86 26.23,74.57 arc90 27.33,74.57 27.73,74.97 arc-90 28.2,74.97 28.45,74.72 arc-90 28.45,74.25 28.05,73.85 arc90 28.05,72.75 28.35,72.44 arc90 29.45,72.44 31.8,74.8 arc-90 32.27,74.8 32.5,74.57 arc-90 32.5,74.1 30.15,71.75 arc90 30.15,70.65 30.53,70.26 arc90 31.64,70.26 34.06,72.69 arc-90 34.54,72.69 34.75,72.47 arc-90 34.75,72 32.32,69.57 arc90 32.32,68.47 32.6,68.19 arc90 33.7,68.19 36.13,70.62 arc-90 36.6,70.62 36.85,70.37 arc-90 36.85,69.9 34.42,67.47 arc90 34.42,66.37 34.84,65.95 arc90 35.94,65.95 37.16,67.17 arc-90 37.63,67.17 37.96,66.84 arc-90 37.96,66.36 36.75,65.15 arc90 36.75,64.05 38.42,62.38 38.42,43.57 37.65,42.8 U1.48
DATA2_0_N
  Top 0.295: HDMI2.P$9 11.21,59.89 11.48,59.62 25.47,59.62 25.6,59.48 arc90 26.07,59.48 26.24,59.65 arc-90 27.35,59.65 27.41,59.59 arc-90 27.41,58.48 27.24,58.32 arc90 27.24,57.84 27.28,57.8 arc90 27.76,57.8 28.76,58.8 arc-90 29.86,58.8 29.97,58.7 arc-90 29.97,57.59 28.97,56.59 arc90 28.97,56.12 30.29,54.79 30.29,46.44 30.41,46.31 U1.56
DATA2_0_P
  Top 0.295: HDMI2.P$7 11.21,58.89 11.48,59.17 25.29,59.17 arc90 26.39,59.17 26.56,59.34 arc-90 27.03,59.34 27.1,59.27 arc-90 27.1,58.8 26.93,58.63 arc90 26.93,57.53 26.97,57.49 arc90 28.07,57.49 29.07,58.49 arc-90 29.55,58.49 29.66,58.38 arc-90 29.66,57.91 28.65,56.91 arc90 28.65,55.8 29.84,54.61 29.84,45.95 29.91,45.88 U1.57
DATA2_1_N
  Top 0.295: HDMI2.P$6 11.21,58.39 11.48,58.12 22.21,58.12 22.46,57.87 arc90 22.93,57.87 23.31,58.24 arc-90 24.41,58.24 24.41,58.24 arc-90 24.41,57.13 24.04,56.76 arc90 24.04,56.29 24.14,56.19 arc90 24.61,56.19 25.36,56.94 arc-90 26.46,56.94 26.51,56.89 arc-90 26.51,55.78 25.76,55.03 arc90 25.76,54.56 25.82,54.51 arc90 26.29,54.51 27.04,55.26 arc-90 28.14,55.26 28.16,55.24 arc-90 28.16,54.13 27.41,53.38 arc90 27.41,52.91 28.7,51.62 28.7,46.04 28.91,45.83 U1.59
DATA2_1_P
  Top 0.295: HDMI2.P$4 11.21,57.39 11.48,57.67 22.02,57.67 22.14,57.55 arc90 23.25,57.55 23.62,57.93 arc-90 24.09,57.93 24.1,57.92 arc-90 24.1,57.45 23.72,57.07 arc90 23.72,55.97 23.82,55.87 arc90 24.93,55.87 25.68,56.62 arc-90 26.15,56.62 26.2,56.57 arc-90 26.2,56.1 25.45,55.35 arc90 25.45,54.25 25.5,54.19 arc90 26.61,54.19 27.36,54.94 arc-90 27.83,54.94 27.85,54.92 arc-90 27.85,54.45 27.1,53.7 arc90 27.1,52.6 28.26,51.44 28.26,45.76 28.41,45.6 U1.60
DATA2_2_N
  Top 0.295: HDMI2.P$3 11.21,56.89 11.48,56.62 18.31,56.62 18.53,56.39 arc90 19,56.39 19.38,56.77 arc-90 20.48,56.77 20.51,56.74 arc-90 20.51,55.63 20.14,55.26 arc90 20.14,54.79 20.17,54.76 arc90 20.64,54.76 21.69,55.81 arc-90 22.79,55.81 22.91,55.69 arc-90 22.91,54.59 21.86,53.54 arc90 21.86,53.06 22.01,52.91 arc90 22.48,52.91 23.61,54.04 arc-90 24.71,54.04 24.86,53.89 arc-90 24.86,52.78 23.74,51.66 arc90 23.74,51.19 23.83,51.1 arc90 24.3,51.1 25,51.8 arc-90 26.11,51.8 26.31,51.59 arc-90 26.31,50.48 25.61,49.79 arc90 25.61,49.31 27.39,47.54 27.39,46.42 27.41,46.4 U1.62
DATA2_2_P
  Top 0.295: HDMI2.P$1 11.21,55.89 11.48,56.17 18.12,56.17 18.22,56.08 arc90 19.32,56.08 19.69,56.45 arc-90 20.17,56.45 20.2,56.42 arc-90 20.2,55.95 19.82,55.58 arc90 19.82,54.47 19.85,54.44 arc90 20.96,54.44 22.01,55.49 arc-90 22.48,55.49 22.6,55.37 arc-90 22.6,54.9 21.55,53.85 arc90 21.55,52.75 21.69,52.6 arc90 22.8,52.6 23.92,53.73 arc-90 24.4,53.73 24.55,53.57 arc-90 24.55,53.1 23.42,51.98 arc90 23.42,50.87 23.51,50.78 arc90 24.62,50.78 25.32,51.48 arc-90 25.79,51.48 26,51.27 arc-90 26,50.8 25.3,50.1 arc90 25.3,49 26.94,47.35 26.94,46.42 26.91,46.39 U1.63
DATA3_0_N
  Top 0.295: HDMI3.P$9 11.21,39.89 11.21,39.84 11.43,39.61 23.25,39.61 23.44,39.8 U1.7
DATA3_0_P
  Top 0.295: HDMI3.P$7 11.21,38.89 11.21,38.94 11.43,39.17 23.43,39.17 23.57,39.3 U1.8
DATA3_1_N
  Top 0.295: HDMI3.P$6 11.21,38.39 11.48,38.11 23.25,38.11 23.44,38.3 U1.10
DATA3_1_P
  Top 0.295: HDMI3.P$4 11.21,37.39 11.48,37.67 23.43,37.67 23.57,37.8 U1.11
DATA3_2_N
  Top 0.295: HDMI3.P$3 11.21,36.89 11.48,36.61 23.25,36.61 23.44,36.8 U1.13
DATA3_2_P
  Top 0.295: HDMI3.P$1 11.21,35.89 11.48,36.17 23.43,36.17 23.57,36.3 U1.14
DATAO_0_N
  Top 0.295: HDMIOUT.P$9 8.4,9.41 8.12,9.13 7.06,9.13 6.03,10.16 6.03,15.56 7.11,16.64 7.11,18.1 7.75,18.73 27.47,18.73 27.84,19.11 arc90 27.84,20.21 26.86,21.2 arc-90 26.86,21.67 27.09,21.9 arc-90 27.56,21.9 28.55,20.91 arc90 29.65,20.91 30,21.26 30,32.13 29.91,32.22 U1.24
DATAO_0_P
  Top 0.295: HDMIOUT.P$7 8.43,8.41 8.15,8.69 6.88,8.69 5.59,9.98 5.59,15.74 6.67,16.82 6.67,18.28 7.56,19.18 27.28,19.18 27.53,19.42 arc90 27.53,19.9 26.54,20.88 arc-90 26.54,21.98 26.77,22.21 arc-90 27.88,22.21 28.86,21.23 arc90 29.33,21.23 29.55,21.45 29.55,31.95 29.41,32.09 U1.23
DATAO_1_N
  Top 0.295: U1.21 28.41,31.71 28.39,31.68 28.39,24.45 27.96,24.02 arc-90 26.86,24.02 26.27,24.61 arc90 25.8,24.61 24.18,22.99 arc90 24.18,22.52 24.77,21.93 arc-90 24.77,20.83 24.26,20.32 6.99,20.32 5.71,19.05 5.71,17.15 4.45,15.88 4.45,9.53 6.35,7.62 8.26,7.62 8.54,7.91 HDMIOUT.P$6
DATAO_1_P
  Top 0.295: U1.20 27.91,31.32 27.94,31.29 27.94,24.63 27.65,24.34 arc-90 27.17,24.34 26.59,24.92 arc90 25.48,24.92 23.87,23.31 arc90 23.87,22.2 24.45,21.62 arc-90 24.45,21.15 24.07,20.77 6.8,20.77 5.27,19.23 5.27,17.34 4,16.07 4,9.34 6.17,7.17 8.26,7.17 8.52,6.91 HDMIOUT.P$4
DATAO_2_N
  Top 0.295: HDMIOUT.P$3 8.44,6.41 8.16,6.13 4.66,6.13 2.22,8.57 2.22,18.73 5.08,21.59 19.67,21.59 22.52,24.43 arc90 22.52,25.54 arc-90 22.52,26.01 22.7,26.2 arc-90 23.18,26.2 arc90 24.28,26.2 26.84,28.76 26.84,32.25 26.91,32.32 U1.18
DATAO_2_P
  Top 0.295: HDMIOUT.P$1 8.44,5.41 8.16,5.69 4.48,5.69 1.78,8.39 1.78,18.92 4.9,22.04 19.49,22.04 22.2,24.75 arc90 22.2,25.22 arc-90 22.2,26.32 22.39,26.51 arc-90 23.49,26.51 arc90 23.97,26.51 26.4,28.95 26.4,33.41 U1.17
EQ  (via drill 0.35)
  Top 0.295: v46.01,26.32 43.47,28.86 43.47,30.03 37.7,35.8 U1.34 | SEL_EQ.1 120.65,109.22 121.92,107.95 v121.92,103.19
  Route15 0.295: v46.01,26.32 46.04,26.35 105.09,26.35 arc90 119.06,40.32 119.06,100.33 v121.92,103.19
  Bottom 0.295: SEL_EQ.1 R7.2
GND  (via drill 0.35)
  Top 0.152: v29.21,43.18 29.41,43.38 U1.58 | v26.04,39.05 25.79,38.8 U1.9 | v26.04,35.88 25.96,35.8 U1.15 | v28.89,34.92 28.91,34.91 U1.22 | v31.75,34.92 31.91,34.76 U1.28 | v34.29,40.01 34.59,40.3 U1.43 | U1.3 25.82,41.8 v26.04,41.59
  Top 0.295: v12.06,13.34 11.99,13.41 HDMIOUT.P$17 | HDMIOUT.P$11 11.36,10.41 v11.43,10.48 | HDMIOUT.P$8 11.41,8.91 v11.43,8.89 | HDMIOUT.P$5 11.22,7.41 v11.43,7.62 | HDMIOUT.P$2 11.31,5.91 v11.43,6.03 | HDMI3.P$11 8,40.89 v7.93,40.95 | HDMI3.P$8 7.96,39.39 v7.94,39.37 | HDMI3.P$5 8,37.89 v7.92,37.8 | HDMI3.P$2 8,36.39 v7.91,36.48 | HDMI3.P$17 8.06,43.89 v7.94,43.76 | HDMI2.P$11 8,60.89 v7.93,60.96 | HDMI2.P$8 7.96,59.39 v7.94,59.37 | HDMI2.P$5 8,57.89 v7.92,57.81 | HDMI2.P$2 8,56.39 v7.91,56.48 | HDMI2.P$17 8.06,63.89 v7.94,63.77 | HDMI1.P$11 8,80.58 v7.93,80.64 | HDMI1.P$8 7.96,79.08 v7.94,79.06 | HDMI1.P$5 8,77.58 v7.92,77.49 | HDMI1.P$2 8,76.08 v7.91,76.17 | HDMI1.P$17 8.06,83.58 v7.94,83.45
  Bottom 0.152: C3.2 29.07,43.31 v29.21,43.18 | C4.2 25.9,39.19 v26.04,39.05 | C5.2 25.22,35.88 v26.04,35.88 | C6.2 28.76,34.79 v28.89,34.92 | C7.2 31.93,34.74 v31.75,34.92 | C13.2 34.42,39.87 v34.29,40.01 | R1.1 v20,35.24 | C8.2 35.74,44.95 v35.88,45.09
  other vias: 20.32,111.44 20.32,112.71 22.23,108.9 22.23,110.81 21.27,106.05 19.37,106.05 18.41,107.95 17.14,107.95 110.81,104.78 112.08,104.78 113.03,103.19 6.35,105.41 6.35,107 7.3,107.95 8.89,107.95 9.84,107 9.84,105.41 9.84,103.82 8.89,102.87 7.3,102.87 6.35,103.82
  pour Route2 (isolate 1.27, no thermals, hatched): 95.25,98.42 149.86,98.42 149.86,94.61 arc-61 145.41,87 arc2 134.62,80.64 arc58 130.81,73.98 130.81,41.27 arc-90 104.14,14.61 60.33,14.61 arc90 50.16,4.45 50.16,0 43.81,0 43.81,41.28 50.16,41.28 arc90 60.33,31.11 104.14,31.11 arc90 114.3,41.27 114.3,73.98 arc59 110.49,80.64 99.69,87 arc-59 95.25,94.61
  pour Route2 (isolate 0.508, rank 2, no thermals): 0,114.3 50.16,114.3 50.16,45.72 48.9,45.72 48.9,0 0,0
  pour Route2 (isolate 0.508, rank 2, no thermals): 95.25,95.21 149.86,95.21 149.86,114.3 95.25,114.3
  pour Top (no thermals): 22.86,105.41 16.51,105.41 16.51,108.58 11.75,108.58 11.75,102.23 0.58,102.23 0.58,113.72 22.86,113.72
  pour Top (no thermals): 110.17,101.92 114.62,101.92 114.62,105.41 110.17,105.41
  pour Top (isolate 0.508, rank 2, no thermals): 95.25,95.21 95.25,114.3 149.86,114.3 149.86,95.21
  pour Bottom (isolate 0.508, rank 2, no thermals): 95.25,95.21 149.86,95.21 149.86,114.3 95.25,114.3
  pour Top (isolate 0.508, rank 2, no thermals): 0,114.3 50.16,114.3 50.16,45.72 48.9,45.72 48.9,0 0,0
  pour Route15 (isolate 0.508, rank 3, no thermals): 22.86,105.41 22.86,114.3 0,114.3 0,0 14.61,0 14.61,12.7 10.16,12.7 10.16,22.86 11.75,24.45 11.75,28.89 10.16,30.48 10.16,90.49 11.75,92.08 11.75,99.06 9.53,99.06 8.57,100.01 8.57,101.28 9.53,102.23 11.75,102.23 11.75,108.58 16.51,108.58 16.51,105.41
  pour Bottom (isolate 0.508, rank 2, no thermals): 0,114.3 50.16,114.3 50.16,45.72 48.9,45.72 48.9,0 0,0
N$1
  Route15 1.905: 128.59,98.42 128.59,41.27 arc-90 104.14,16.83 46.35,16.83
N$2
  cutout Bottom: 50.16,109.86 46.99,109.86 46.99,102.23 50.16,102.23
N$3
  Route15 1.905: 116.52,98.42 116.52,41.27 arc-90 104.14,28.89 46.35,28.89
N$4
  cutout Route15: 50.16,109.86 46.99,109.86 46.99,102.23 50.16,102.23
N$5
  cutout Route2: 50.16,109.86 46.99,109.86 46.99,102.23 50.16,102.23
N$6
  cutout Top: 50.16,109.86 46.99,109.86 46.99,102.23 50.16,102.23
N$25  (via drill 0.35)
  Top 0.152: v25.72,44.77 26.33,44.77 U1.64
  Top 0.295: HDMI3.P$19 11.25,44.89 11.43,45.07 v11.43,45.09
  Bottom 0.152: v25.72,44.77 11.75,44.77 v11.43,45.09
N$26  (via drill 0.35)
  Top 0.152: v33.97,46.04 33.66,46.04 33.41,45.8 U1.50
  Top 0.295: HDMI2.P$19 11.25,64.89 11.43,65.07 v11.43,65.09
  Bottom 0.152: v11.43,65.09 11.75,65.09 16.51,60.33 24.13,60.33 33.97,50.48 v33.97,46.04
N$27  (via drill 0.35)
  Top 0.152: v34.29,35.66 34.94,36.3 U1.35
  Top 0.295: HDMI1.P$19 11.25,84.58 11.43,84.75 v11.43,84.77
  Bottom 0.152: v11.43,84.77 39.05,57.15 39.05,36.83 37.88,35.66 v34.29,35.66
N$36  (via drill 0.35)
  Top 0.152: v32.7,30.48 34.29,30.48 34.61,30.8 34.61,31.51 33.41,32.71 U1.31
  Top 0.295: v11.43,14.61 11.23,14.41 HDMIOUT.P$19
  Bottom 0.152: v11.43,14.61 11.75,14.92 30.48,14.92 32.7,17.14 v32.7,30.48
N$37  (via drill 0.35)
  Top 0.152: U1.1 23.55,42.8 23.18,43.18 v22.54,43.18
  Top 0.295: HDMI3.P$16 11.27,43.39 v11.43,43.23
  Bottom 0.152: v11.43,43.23 11.47,43.18 v22.54,43.18
N$38  (via drill 0.35)
  Top 0.152: v23.19,42.24 23.25,42.3 U1.2
  Top 0.295: HDMI3.P$15 7.96,42.89 v7.94,42.86
  Bottom 0.152: v7.94,42.86 8.26,42.55 22.26,42.55 22.56,42.24 v23.19,42.24 23.51,42.56 24.01,42.56 R2.1
N$39  (via drill 0.35)
  Top 0.152: v32.92,46.18 U1.51
  Top 0.295: HDMI2.P$16 11.27,63.39 v11.43,63.23
  Bottom 0.152: v11.43,63.23 15.22,59.44 23.47,59.44 32.92,49.99 v32.92,46.18
N$40  (via drill 0.35)
  Top 0.152: v32.38,43.18 32.38,44.66 U1.52
  Top 0.295: HDMI2.P$15 7.96,62.89 v7.94,62.87
  Bottom 0.152: v32.38,43.18 32.52,43.31 R4.1 31.61,45.05 31.61,49.93 22.86,58.67 14.63,58.67 10.44,62.87 v7.94,62.87
N$41  (via drill 0.35)
  Top 0.152: v34.29,37.47 34.45,37.3 U1.37
  Top 0.295: HDMI1.P$15 7.96,82.58 v7.94,82.55
  Bottom 0.152: v7.94,82.55 9.53,82.55 37.15,54.93 37.15,38.1 36.51,37.47 v34.29,37.47 R3.1
N$42  (via drill 0.35)
  Top 0.152: v33.97,36.51 34.26,36.8 U1.36
  Top 0.295: HDMI1.P$16 11.27,83.08 v11.43,82.91
  Bottom 0.152: v11.43,82.91 38.1,56.24 38.1,37.78 37.15,36.83 34.29,36.83 v33.97,36.51
N$43  (via drill 0.35)
  Top 0.152: v33.97,31.11 33.97,31.43 32.91,32.49 U1.30
  Top 0.295: HDMIOUT.P$16 11.54,12.91 12.06,12.38 v13.02,12.38
  Bottom 0.152: v13.02,12.38 30.48,12.38 33.97,15.88 v33.97,31.11 33.97,32.07 33.02,33.02 R6.1
N$44  (via drill 0.35)
  Top 0.152: v32.89,31.62 32.41,32.1 U1.29
  Top 0.295: HDMIOUT.P$15 11.09,12.41 v11.43,12.06
  Bottom 0.152: v11.43,12.06 11.75,12.06 13.34,13.65 30.48,13.65 33.34,16.51 33.34,31.17 v32.89,31.62 32.44,32.07 R5.1
N$45  (via drill 0.35)
  Top 0.152: v23.18,35.24 23.24,35.3 U1.16
  Bottom 0.152: R1.2 v23.18,35.24
N$50  (via drill 0.35)
  Top 0.295: v107.95,104.46 107.95,102.87 109.22,101.6 115.25,101.6 116.84,103.19 IC1.6
  pour Bottom (isolate 0.254, no thermals): 105.41,101.92 107.63,101.92 107.63,96.52 109.86,96.52 109.86,106.68 107.63,106.68 107.63,103.5 105.41,103.5
N$51  (via drill 0.35)
  Top 0.295: v119.38,104.46 119.12,104.2 IC1.5
  pour Bottom (isolate 0.254, no thermals): 116.84,101.92 119.06,101.92 119.06,96.52 121.28,96.52 121.28,106.68 119.06,106.68 119.06,103.5 116.84,103.5
N$52  (via drill 0.35)
  Top 0.295: v130.81,104.46 124.78,104.46 124.14,103.82 124.14,97.47 123.51,96.84 117.47,96.84 116.84,97.47 IC1.3
  pour Bottom (isolate 0.254, no thermals): 128.27,101.92 130.49,101.92 130.49,96.52 132.72,96.52 132.72,106.68 130.49,106.68 130.49,103.5 128.27,103.5
S1  (via drill 0.35)
  Top 0.295: v44.13,23.18 41.59,25.72 41.59,28.89 37.06,33.42 U1.32 | IC1.4 118.11,100.65 118.75,101.28 v123.19,101.28
  Route15 0.295: v44.13,23.18 104.46,23.18 arc90 122.24,40.96 122.24,100.33 v123.19,101.28
S2  (via drill 0.35)
  Top 0.295: v45.09,24.77 42.55,27.3 42.55,29.53 36.77,35.3 U1.33 | IC1.2 115.57,100.97 116.84,102.23 v122.56,102.23
  Route15 0.295: v45.09,24.77 104.78,24.77 arc90 120.65,40.64 120.65,100.33 v122.56,102.23
VCC  (via drill 0.35)
  Top 0.152: U1.61 27.94,44.66 v27.94,43.18 | v26.06,40.3 U1.6 | v26.04,37.15 25.79,37.15 25.63,37.3 U1.12 | v27.62,34.92 27.41,34.72 U1.19 | v30.48,34.92 30.48,34.76 30.41,34.69 U1.25 | v34.29,38.73 34.36,38.8 U1.40 | U1.55 30.91,43.3 v30.8,43.18 | U1.46 34.4,41.8 v34.29,41.91
  Route15 2.54: 46.35,20.32 104.46,20.32 arc90 125.09,40.96 125.09,100.01
  Bottom 0.152: v27.94,43.18 27.94,44 C3.1 | C4.1 25.95,40.19 v26.06,40.3 | C5.1 25.9,37.01 v26.04,37.15 | C6.1 27.62,34.11 v27.62,34.92 | C7.1 30.93,34.47 v30.48,34.92 | C13.1 35.11,38.73 v34.29,38.73
  Bottom 0.295: R8.2 v105.09,100.65 | v116.52,100.65 v116.53,100.65 R9.2 | v127.95,100.65 R10.2
  other vias: 24.13,110.81 26.67,108.9 27.94,108.9 29.21,108.9 30.48,108.9 31.75,108.9 31.75,107.63 31.75,106.36 31.75,105.09 31.75,103.82 31.75,102.55 31.75,101.28 30.48,101.28 29.21,101.28 27.94,101.28 26.67,101.28 25.4,101.28 24.13,101.28 24.13,102.55 24.13,103.82 24.13,105.09 24.13,106.36 24.13,107.63 26.04,111.44 26.04,112.71 25.4,108.9 24.13,108.9 112.08,99.06 110.81,99.06 113.03,100.01
  pour Route15 (isolate 0.508, no thermals): 95.25,95.21 95.25,114.3 149.86,114.3 149.86,95.21 130.18,95.21 130.18,99.38 129.54,100.01 127.64,100.01 127,99.38 127,95.21 123.9,95.21 123.9,102.79 122.56,104.14 121.28,104.14 117.16,100.01 115.57,100.01 114.94,99.38 114.94,95.21
  pour Top (no thermals): 110.17,101.28 114.62,101.28 114.62,97.79 110.17,97.79
  pour Top (no thermals): 23.5,100.65 23.5,113.72 32.38,113.72 32.38,100.65
  pour Route15 (isolate 0.508, rank 2, no thermals): 23.5,114.3 50.16,114.3 50.16,45.72 48.9,45.72 48.9,0 14.92,0 14.92,22.54 16.51,24.13 16.51,29.21 14.92,30.8 14.92,42.55 15.56,43.18 22.54,43.18 23.18,42.55 25.4,42.55 26.99,44.13 32.07,44.13 32.38,43.81 32.38,43.18 32.07,42.86 31.43,42.86 31.11,42.55 31.11,35.88 31.43,35.56 32.7,35.56 33.02,35.88 33.02,40.01 33.97,40.96 33.97,41.59 35.56,43.18 35.56,46.35 34.92,46.99 15.56,46.99 14.92,47.62 14.92,90.17 16.51,91.76 16.51,96.52 18.73,98.74 22.23,98.74 23.5,100.01
  pour Bottom (no thermals): 29.84,34.61 29.84,35.24 30.16,35.56 30.8,35.56 31.11,35.24 31.11,34.61 31.43,34.29 31.43,31.75 31.11,31.43 30.48,31.43 30.16,31.75 30.16,34.29

### Text on the board
Top: 1 | Top
Route2: 2 | Flex1
Route15: 3 | Flex2
Bottom: 4 | Bottom
tPlace: HDMI Rigid-Flex Switch / Texas Instruments TMDS351 / Rev v1.0 | Maxim Yudayev | 07/05/2021 / KU Leuven - GroupT
Document: 1Ri-2F-1Ri 0.744mm Rigid-Flex WE Build | 15um Soldermask IPC-SM840 -> Epsilon_r 3.5 | Layer 1 - HS Digital -> 30um (1/4 oz) copper | 105um Prepreg IPC-4101/127/128 -> Epsilon_r 3.8 / 180um Prepreg IPC-4101/127/128 -> Epsilon_r 3.9 | Layer 2 - HS GND + Flex Signal -> 17um ED Base Copper | 50um Flexible Core IPC-4204/11 -> Epsilon_r 3.4 | Layer 15 - Power + GND -> 17um ED Base Copper | 180um Prepreg IPC-4101/127/128 -> Epsilon_r 3.9 / 105um Prepreg IPC-4101/127/128 -> Epsilon_r 3.8 | Layer 16 - Signal + GND -> 30um (1/4 oz) copper | 15um Soldermask IPC-SM840 -> Epsilon_r 3.5 | Surface Edge-Coupled Stripline Impedance Control: / / 100 Ohm Differential - 295um (width), 150um (space) | Rigid outline layer - 210 / Flex outline layer - 211